# Altium project TFTInstrumentCluster.PrjPCB (part 1 of 2)
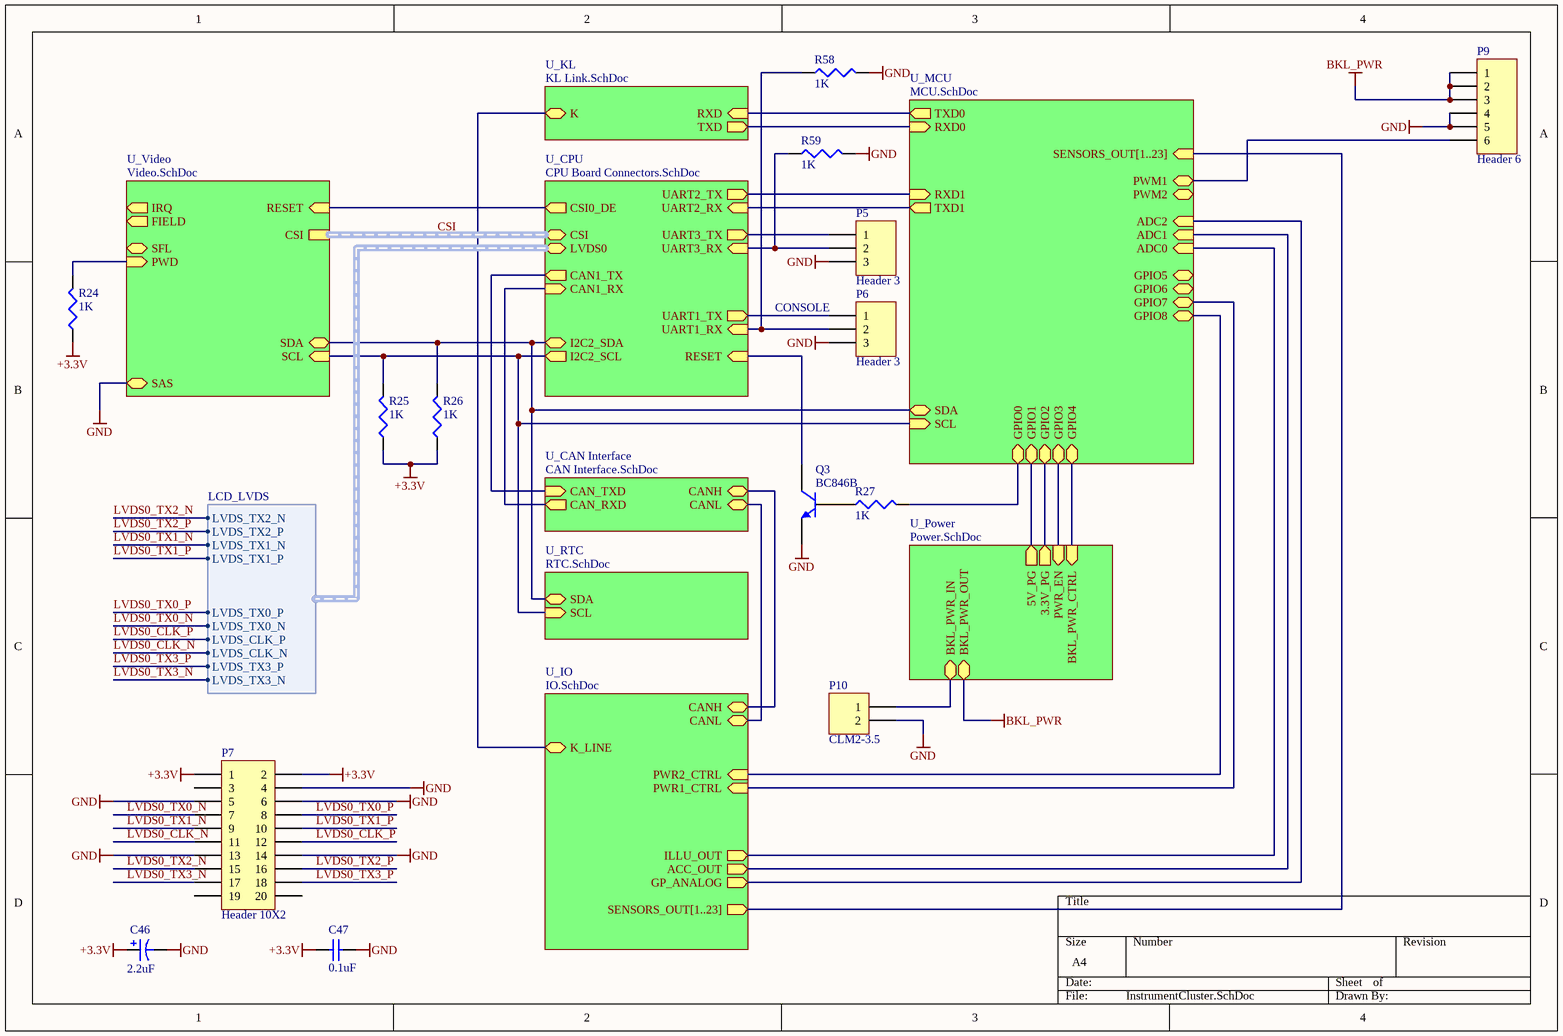
[diagram p0: InstrumentCluster.SchDoc]
11 sheets, 296 parts. Net scope: hierarchical (ports join the sheet entries above them; power ports are global).
Board file: InstrumentCluster.PcbDoc
Sheets:
  InstrumentCluster.SchDoc
    U_Power = Power.SchDoc
    U_Video = Video.SchDoc
    U_CPU = CPU Board Connectors.SchDoc
    U_MCU = MCU.SchDoc
    U_CAN Interface = CAN Interface.SchDoc
    U_KL = KL Link.SchDoc
    U_RTC = RTC.SchDoc
    U_IO = IO.SchDoc
      LC1 = LevelConverter.SchDoc
      LC2 = LevelConverter.SchDoc
      LC3 = LevelConverter.SchDoc
      LC4 = LevelConverter.SchDoc
      LC5 = LevelConverter.SchDoc
      LC6 = LevelConverter.SchDoc
      LC7 = LevelConverter.SchDoc
      LC8 = LevelConverter.SchDoc
      LC9 = LevelConverter.SchDoc
      LC10 = LevelConverter.SchDoc
      LC11 = LevelConverter.SchDoc
      LC12 = LevelConverter.SchDoc
      LC13 = LevelConverter.SchDoc
      LC14 = LevelConverter.SchDoc
      LC15 = LevelConverter.SchDoc
      LC16 = LevelConverter.SchDoc
      LC17 = LevelConverter.SchDoc
      LC18 = LevelConverter.SchDoc
      LC19 = LevelConverter.SchDoc
      LC20 = LevelConverter.SchDoc
      LC21 = LevelConverter.SchDoc
      LC22 = LevelConverter.SchDoc
      LC23 = LevelConverter.SchDoc
  External Connectors.SchDoc

## Sheet InstrumentCluster.SchDoc
size A4

### Parts
C46  2.2uF  [6032]
C47  0.1uF  [2012[0805]]
P5  Header 3  [HDR1X3]
P6  Header 3  [HDR1X3]
P7  Header 10X2  [HDR2X10]
P9  Header 6  [HDR1X6]
P10  CLM2-3.5  [CLM2-3.5]
Q3  BC846B  [SOT23_N]
R24  1K  [R2012[0805]]
R25  1K  [R2012[0805]]
R26  1K  [R2012[0805]]
R27  1K  [R2012[0805]]
R58  1K  [R2012[0805]]
R59  1K  [R2012[0805]]

### Sub-sheets
U_CAN Interface = CAN Interface.SchDoc: CAN_TXD (in), CAN_RXD (out), CANH (bidir), CANL (bidir)
U_CPU = CPU Board Connectors.SchDoc: CSI (harness CSI), CAN1_TX (out), CAN1_RX (in), I2C2_SDA (bidir), I2C2_SCL (out), UART2_TX (out), UART2_RX (in), UART3_RX (in), UART1_RX (in), UART3_TX (out), UART1_TX (out), RESET (in), LVDS0 (harness LCD_LVDS), CSI0_DE (out)
U_IO = IO.SchDoc: ILLU_OUT (out), ACC_OUT (out), K_LINE (bidir), CANH (bidir), CANL (bidir), PWR1_CTRL (in), PWR2_CTRL (in), GP_ANALOG (out), SENSORS_OUT[1..23] (out)
U_KL = KL Link.SchDoc: K (bidir), RXD (in), TXD (out)
U_MCU = MCU.SchDoc: PWM1 (bidir), SDA (bidir), SCL (in), GPIO5 (bidir), RXD1 (in), TXD1 (out), TXD0 (out), RXD0 (in), ADC1 (in), ADC0 (in), PWM2 (bidir), ADC2 (in), GPIO6 (bidir), GPIO7 (bidir), GPIO8 (bidir), SENSORS_OUT[1..23] (in), GPIO0 (bidir), GPIO1 (bidir), GPIO2 (bidir), GPIO3 (bidir), GPIO4 (bidir)
U_Power = Power.SchDoc: 3.3V_PG (out), 5V_PG (out), PWR_EN (in), BKL_PWR_CTRL (in), BKL_PWR_IN, BKL_PWR_OUT
U_RTC = RTC.SchDoc: SCL (in), SDA (bidir)
U_Video = Video.SchDoc: RESET (in), IRQ (out), FIELD (out), CSI (harness CSI), SFL (bidir), PWD (in), SCL (in), SDA (bidir), SAS

### Harnesses
LCD_LVDS: LVDS_TX0_P, LVDS_TX0_N, LVDS_TX1_P, LVDS_TX1_N, LVDS_TX2_P, LVDS_TX2_N, LVDS_CLK_P, LVDS_CLK_N, LVDS_TX3_P, LVDS_TX3_N

### Nets
+3.3V: C46.1 C47.2 P7.1 P7.2 R24.1 R25.1 R26.1
BKL_PWR: P9.1 P9.2 P9.3 ; sheet U_Power/BKL_PWR_OUT
GND: C46.2 C47.1 P5.3 P6.3 P7.4 P7.5 P7.6 P7.13 P7.14 P9.4 P9.5 P10.2 Q3.2(E) R58.2 R59.2 ; sheet U_Video/SAS
ACC_OUT: sheet U_MCU/ADC1, sheet U_IO/ACC_OUT
ADV_RST: sheet U_Video/RESET, sheet U_CPU/CSI0_DE
CAN1_RX: sheet U_CPU/CAN1_RX, sheet U_CAN Interface/CAN_RXD
CAN1_TX: sheet U_CPU/CAN1_TX, sheet U_CAN Interface/CAN_TXD
GP_ANALOG: sheet U_MCU/ADC2, sheet U_IO/GP_ANALOG
I2C2_SCL: R25.2 ; sheet U_Video/SCL, sheet U_CPU/I2C2_SCL, sheet U_MCU/SCL, sheet U_RTC/SCL
I2C2_SDA: R26.2 ; sheet U_Video/SDA, sheet U_CPU/I2C2_SDA, sheet U_MCU/SDA, sheet U_RTC/SDA
ILLU_OUT: sheet U_MCU/ADC0, sheet U_IO/ILLU_OUT
LVDS0_CLK_N: P7.11 ; sheet U_CPU/LVDS0.LVDS_CLK_N
LVDS0_CLK_P: P7.12 ; sheet U_CPU/LVDS0.LVDS_CLK_P
LVDS0_TX0_N: P7.7 ; sheet U_CPU/LVDS0.LVDS_TX0_N
LVDS0_TX0_P: P7.8 ; sheet U_CPU/LVDS0.LVDS_TX0_P
LVDS0_TX1_N: P7.9 ; sheet U_CPU/LVDS0.LVDS_TX1_N
LVDS0_TX1_P: P7.10 ; sheet U_CPU/LVDS0.LVDS_TX1_P
LVDS0_TX2_N: P7.15 ; sheet U_CPU/LVDS0.LVDS_TX2_N
LVDS0_TX2_P: P7.16 ; sheet U_CPU/LVDS0.LVDS_TX2_P
LVDS0_TX3_N: P7.17 ; sheet U_CPU/LVDS0.LVDS_TX3_N
LVDS0_TX3_P: P7.18 ; sheet U_CPU/LVDS0.LVDS_TX3_P
MISO: sheet U_MCU/TXD0, sheet U_KL/RXD
RESET: Q3.3(C) ; sheet U_CPU/RESET
UART1_RX: P6.2 R58.1 ; sheet U_CPU/UART1_RX
UART1_TX: P6.1 ; sheet U_CPU/UART1_TX
UART2_RX: sheet U_CPU/UART2_RX, sheet U_MCU/TXD1
UART2_TX: sheet U_CPU/UART2_TX, sheet U_MCU/RXD1
UART3_RX: P5.2 R59.1 ; sheet U_CPU/UART3_RX
UART3_TX: P5.1 ; sheet U_CPU/UART3_TX
VIN: P10.1 ; sheet U_Power/BKL_PWR_IN
NetP9_6: P9.6 ; sheet U_MCU/PWM1
NetP15_1: sheet U_CAN Interface/CANH, sheet U_IO/CANH
NetP15_2: sheet U_CAN Interface/CANL, sheet U_IO/CANL
NetP21_1: sheet U_KL/K, sheet U_IO/K_LINE
NetQ3_1: Q3.1(B) R27.1
NetR7_2: sheet U_Power/PWR_EN, sheet U_MCU/GPIO3
NetR12_2: sheet U_Power/BKL_PWR_CTRL, sheet U_MCU/GPIO4
NetR24_2: R24.2 ; sheet U_Video/PWD
NetR27_2: R27.2 ; sheet U_MCU/GPIO0
NetR38_2: sheet U_MCU/RXD0, sheet U_KL/TXD
NetR43_2: sheet U_MCU/GPIO7, sheet U_IO/PWR1_CTRL
NetR49_2: sheet U_MCU/GPIO8, sheet U_IO/PWR2_CTRL
NetU1_7: sheet U_Power/3.3V_PG, sheet U_MCU/GPIO2
NetU2_7: sheet U_Power/5V_PG, sheet U_MCU/GPIO1

Not connected (* = marked no-connect by the designer): P7 3 19 20

### Buses and harness runs
bus sheet U_IO/SENSORS_OUT[1..23] = sheet U_MCU/SENSORS_OUT[1..23]
harness CSI = sheet U_CPU/CSI = sheet U_Video/CSI

### Notes on the sheet
- CONSOLE

### Library data of the parts
C46 = 893D225X0025C2: Tantamount Built-In-Fuse Miniature, Molded-Case Solid Tantalum Chip Capacitor: 2.2uF, 20% Tolerance, 25 WVDC @ +85°C, Surge = 32V; Note: See Data Sheet for full range of components; Published: 19-Mar-2004; DatasheetDocument: 04-Feb-2003; PackageReference: 6032; Publisher: Altium Limited; Code_JEITA: 6032; ComponentLink1Description: Manufacturer Link; ComponentLink1URL: http://www.vishay.com/; ComponentLink2Description: Datasheet; ComponentLink2URL: http://www.vishay.com/docs/40008/893d.pdf; Value: 2.2uF
C47 = C0805: Ceramic Chip Capacitor - Standard; Note: Footprint corresponds to dimensions for bulk cassette packaging. This case size has tightened tolerances.; Published: 17-Jul-2002; LatestRevisionDate: 19-Mar-2004; LatestRevisionNote: Silkscreen size reduced.; DatasheetDocument: Mar-2001; PackageDocument: Mar-2001; PackageReference: 0805; Publisher: Altium Limited; Code_JEITA: 0805; Code_IPC: 2012[0805]; ComponentLink1Description: Manufacturer Link; ComponentLink1URL: http://www.kemet.com/; ComponentLink2Description: Datasheet; ComponentLink2URL: http://www.kemet.com/kemet/web/homepage/kechome.nsf/vapubfilesname/F3102TA.pdf/$file/F3102TA.pdf; Value: 0.1uF
P5 P6 = Header 3: Header, 3-Pin; LatestRevisionDate: 17-Jul-2002; LatestRevisionNote: Re-released for DXP Platform.; Publisher: Altium Limited
P7 = Header 10X2: Header, 10-Pin, Dual row; LatestRevisionDate: 17-Jul-2002; LatestRevisionNote: Re-released for DXP Platform.; Publisher: Altium Limited
P9 = Header 6: Header, 6-Pin; LatestRevisionDate: 17-Jul-2002; LatestRevisionNote: Re-released for DXP Platform.; Publisher: Altium Limited
Q3 = BC846B: NPN General-purpose Transistor; Published: 17-Sep-2003; LatestRevisionDate: 12-Dec-2006; LatestRevisionNote: IPC-7351 Footprint Added.; DatasheetVersion: 4-Feb-2002; PackageVersion: May-1999; PackageReference: SOT23; Publisher: Altium Limited; PackageDescription: 3-Pin SOT-23 Package 0.95 mm Pitch, 2.3 mm Lead Span; ComponentLink1Description: Manufacturer Link; ComponentLink1URL: http://www.semiconductors.philips.com/; ComponentLink2Description: Datasheet; ComponentLink2URL: http://www.semiconductors.philips.com/acrobat/datasheets/BC846_BC847_BC848_5.pdf
R24-R27 R58 R59 = R0805: Published: 8-Jun-2000; LatestRevisionDate: 29-May-2009; LatestRevisionNote: IPC-7351 Footprint Added.; PackageReference: J1-0603; Publisher: Altium Limited; PackageDescription: Chip Resistor; Value: 1K

## Sheet Power.SchDoc
size A4
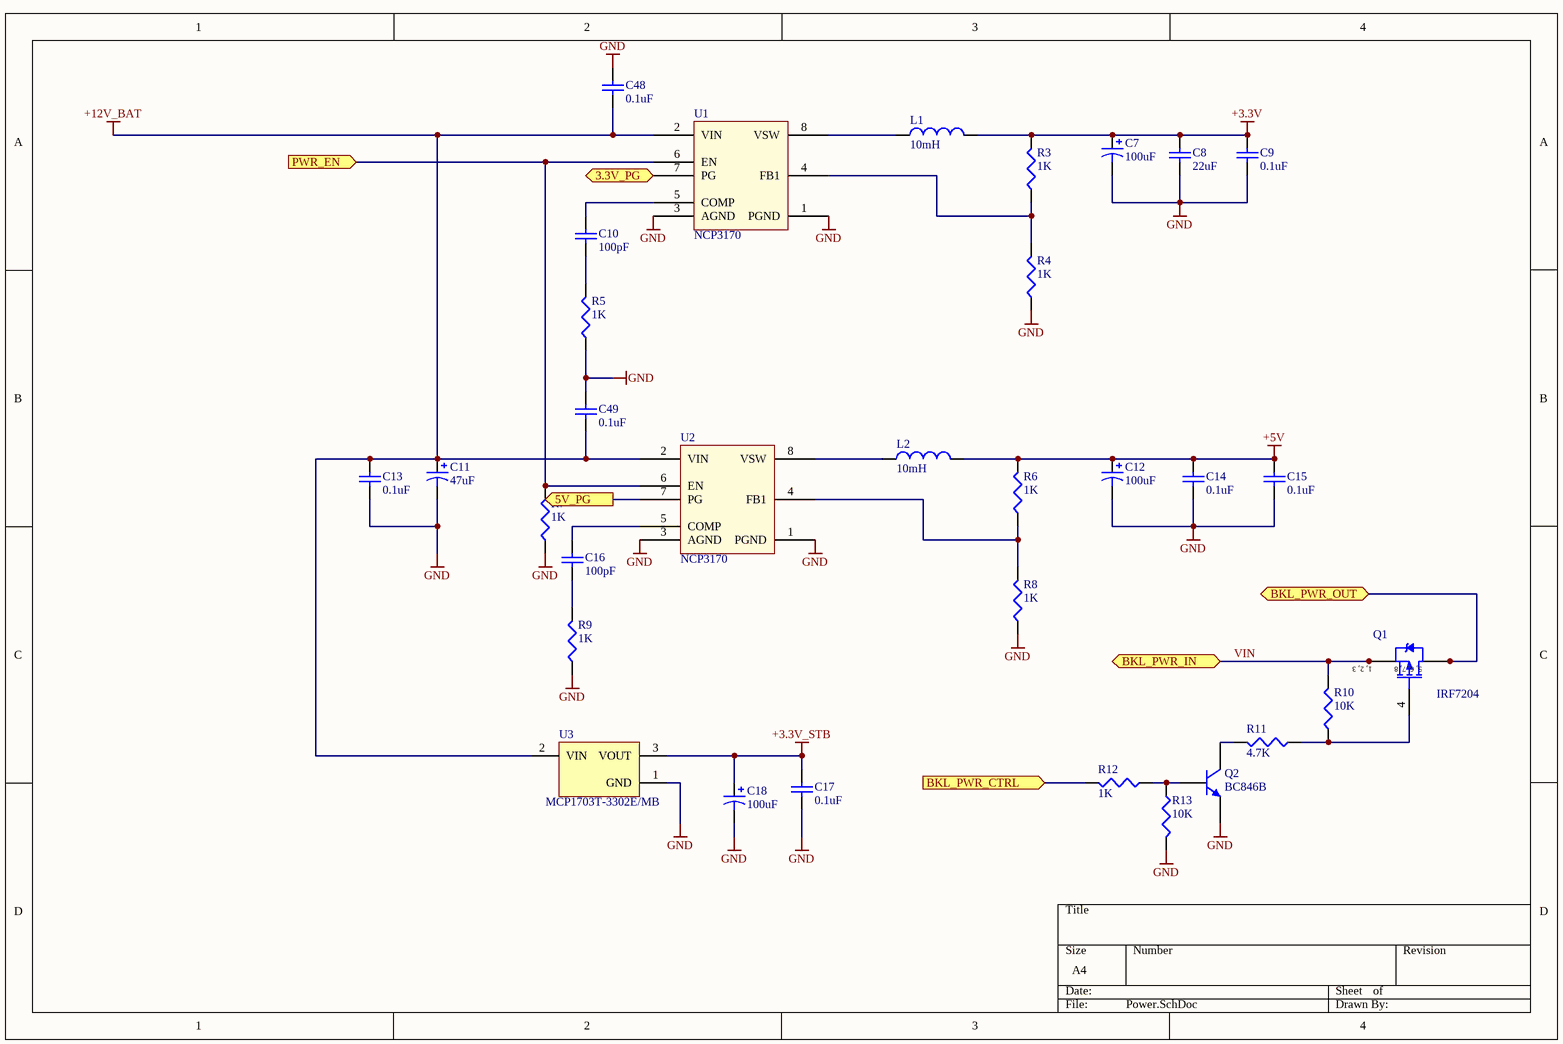
[diagram p1: Power.SchDoc]

### Parts
C7  100uF  [6032]
C8  22uF  [2012[0805]]
C9  0.1uF  [2012[0805]]
C10  100pF  [1608[0603]]
C11  47uF  [7343]
C12  100uF  [6032]
C13  0.1uF  [2012[0805]]
C14  0.1uF  [2012[0805]]
C15  0.1uF  [2012[0805]]
C16  100pF  [1608[0603]]
C17  0.1uF  [2012[0805]]
C18  100uF  [6032]
C48  0.1uF  [2012[0805]]
C49  0.1uF  [2012[0805]]
L1  10mH  [CDRH127]
L2  10mH  [CDRH127]
Q1  IRF7204  [SO-8_N]
Q2  BC846B  [SOT23_N]
R3  1K  [R2012[0805]]
R4  1K  [R2012[0805]]
R5  1K  [R1608[0603]]
R6  1K  [R2012[0805]]
R7  1K  [R1608[0603]]
R8  1K  [R2012[0805]]
R9  1K  [R1608[0603]]
R10  10K  [R2012[0805]]
R11  4.7K  [R2012[0805]]
R12  1K  [R2012[0805]]
R13  10K  [R2012[0805]]
U1  NCP3170  [SOIC127P600-8AM]
U2  NCP3170  [SOIC127P600-8AM]
U3  MCP1703T-3302E/MB  [SOT-89-MB3_N]

### Ports
3.3V_PG (out), 5V_PG (out), BKL_PWR_CTRL (in), BKL_PWR_IN, BKL_PWR_OUT, PWR_EN (in)

### Nets
+3.3V: C7.1 C8.2 C9.2 L1.2 R3.2
+3.3V_STB: C17.2 C18.1 U3.3(VOUT)
+5V: C12.1 C14.2 C15.2 L2.2 R6.2
+12V_BAT: C11.1 C13.2 C48.1 C49.1 U1.2(VIN) U2.2(VIN) U3.2(VIN)
BKL_PWR: Q1.5(D) Q1.6(D) Q1.7(D) Q1.8(D) ; port BKL_PWR_OUT
GND: C7.2 C8.1 C9.1 C11.2 C12.2 C13.1 C14.1 C15.1 C17.1 C18.2 C48.2 C49.2 Q2.2(E) R4.1 R5.1 R7.1 R8.1 R9.1 R13.2 U1.1(PGND) U1.3(AGND) U2.1(PGND) U2.3(AGND) U3.1(GND)
VIN: Q1.1(S) Q1.2(S) Q1.3(S) R10.2 ; port BKL_PWR_IN
NetC10_1: C10.1 R5.2
NetC10_2: C10.2 U1.5(COMP)
NetC16_1: C16.1 R9.2
NetC16_2: C16.2 U2.5(COMP)
NetL1_1: L1.1 U1.8(VSW)
NetL2_1: L2.1 U2.8(VSW)
NetQ1_4: Q1.4(G) R10.1 R11.1
NetQ2_1: Q2.1(B) R12.1 R13.1
NetQ2_3: Q2.3(C) R11.2
NetR3_1: R3.1 R4.2 U1.4(FB1)
NetR6_1: R6.1 R8.2 U2.4(FB1)
NetR7_2: R7.2 U1.6(EN) U2.6(EN) ; port PWR_EN
NetR12_2: R12.2 ; port BKL_PWR_CTRL
NetU1_7: U1.7(PG) ; port 3.3V_PG
NetU2_7: U2.7(PG) ; port 5V_PG

### Notes on the sheet
- (in symbol IRF7204) 1, 2, 3; 5, 6, 7, 8

### Library data of the parts
C7 C12 C18 = 893D225X0025C2: as C46 on sheet InstrumentCluster; Published: 19-Mar-2004; DatasheetDocument: 04-Feb-2003; PackageReference: 6032; Publisher: Altium Limited; Code_JEITA: 6032; ComponentLink1Description: Manufacturer Link; ComponentLink1URL: http://www.vishay.com/; ComponentLink2Description: Datasheet; ComponentLink2URL: http://www.vishay.com/docs/40008/893d.pdf; Value: 100uF
C8 C9 C13-C15 C17 C48 C49 = C0805: as C47 on sheet InstrumentCluster; Published: 17-Jul-2002; LatestRevisionDate: 19-Mar-2004; LatestRevisionNote: Silkscreen size reduced.; DatasheetDocument: Mar-2001; PackageDocument: Mar-2001; PackageReference: 0805; Publisher: Altium Limited; Code_JEITA: 0805; Code_IPC: 2012[0805]; ComponentLink1Description: Manufacturer Link; ComponentLink1URL: http://www.kemet.com/; ComponentLink2Description: Datasheet; ComponentLink2URL: http://www.kemet.com/kemet/web/homepage/kechome.nsf/vapubfilesname/F3102TA.pdf/$file/F3102TA.pdf
  C8: Value: 22uF
  C9 C13-C15 C17 C48 C49: Value: 0.1uF
C10 C16 = C0603: Ceramic Chip Capacitor - Standard; Note: Footprint corresponds to dimensions for bulk cassette packaging. This case size has tightened tolerances.; Published: 17-Jul-2002; LatestRevisionDate: 19-Mar-2004; LatestRevisionNote: Silkscreen size reduced.; DatasheetDocument: Mar-2001; PackageDocument: Mar-2001; PackageReference: 0603; Publisher: Altium Limited; Code_JEITA: 0603; Code_IPC: 1608 [0603]; ComponentLink1Description: Manufacturer Link; ComponentLink1URL: http://www.kemet.com/; ComponentLink2Description: Datasheet; ComponentLink2URL: http://www.kemet.com/kemet/web/homepage/kechome.nsf/vapubfilesname/F3102TA.pdf/$file/F3102TA.pdf; Value: 100pF
C11 = 893D156X0025D2: Tantamount Built-In-Fuse Miniature, Molded-Case Solid Tantalum Chip Capacitor: 15uF, 20% Tolerance, 25 WVDC @ +85°C, Surge = 32V; Note: See Data Sheet for full range of components; Published: 19-Mar-2004; DatasheetDocument: 04-Feb-2003; PackageReference: 7343; Publisher: Altium Limited; Code_JEITA: 7343; ComponentLink1Description: Manufacturer Link; ComponentLink1URL: http://www.vishay.com/; ComponentLink2Description: Datasheet; ComponentLink2URL: http://www.vishay.com/docs/40008/893d.pdf; Value: 47uF
L1 L2 = Inductor: Code_IEC: 1005; Published: 8-Jun-2000; LatestRevisionDate: 29-May-2009; LatestRevisionNote: IPC-7351 Footprint Added.; PackageReference: 0402-A; Publisher: Altium Limited; PackageDescription: Chip Inductor; Code_JEITA: 0402; Value: 10mH
Q1 = IRF7204: HEXFET Power MOSFET; Published: 8-Jun-2000; LatestRevisionDate: 13-Apr-2006; LatestRevisionNote: IPC-7351 Footprint Added.; DatasheetVersion: Aug-1997; PackageVersion: Feb-2001; PackageReference: SO-8; Publisher: Altium Limited; PackageDescription: 8-Pin Plastic Small Outline Integrated Circuit 1.27 mm Pitch; Code_JEDEC: MS-012-AA; Code_IPC: SOIC127P600-8; ComponentLink1Description: Manufacturer Link; ComponentLink1URL: http://www.irf.com/; ComponentLink2Description: Datasheet; ComponentLink2URL: http://www.irf.com/product-info/datasheets/data/irf7204.pdf
Q2 = BC846B: NPN General-purpose Transistor; Published: 17-Sep-2003; LatestRevisionDate: 12-Dec-2006; LatestRevisionNote: IPC-7351 Footprint Added.; DatasheetVersion: 4-Feb-2002; PackageVersion: May-1999; PackageReference: SOT23; Publisher: Altium Limited; PackageDescription: 3-Pin SOT-23 Package 0.95 mm Pitch, 2.3 mm Lead Span; ComponentLink1Description: Manufacturer Link; ComponentLink1URL: http://www.semiconductors.philips.com/; ComponentLink2Description: Datasheet; ComponentLink2URL: http://www.semiconductors.philips.com/acrobat/datasheets/BC846_BC847_BC848_5.pdf
R3 R4 R6 R8 R10-R13 = R0805: Published: 8-Jun-2000; LatestRevisionDate: 29-May-2009; LatestRevisionNote: IPC-7351 Footprint Added.; PackageReference: J1-0603; Publisher: Altium Limited; PackageDescription: Chip Resistor
  R3 R4 R6 R8 R12: Value: 1K
  R10 R13: Value: 10K
  R11: Value: 4.7K
R5 R7 R9 = R0603: Published: 8-Jun-2000; LatestRevisionDate: 29-May-2009; LatestRevisionNote: IPC-7351 Footprint Added.; PackageReference: J1-0603; Publisher: Altium Limited; PackageDescription: Chip Resistor; Value: 1K
U1 U2 = TCP3170
U3 = MCP1703T-3302E/MB: 250 mA, 16V, Low Quiescent Current LDO Regulator, 3-Pin SOT-89, Extended Temperature, Tape and Reel; DatasheetVersion: revD, Sep-2009; PackageVersion: revBB, Aug-2009; PackageReference: SOT-89-MB3; PackageDescription: 3-Lead Plastic Small Outline Transistor Header (MB) [SOT-89]; Code_IPC: SOT89; ComponentLink1Description: Manufacturer URL; ComponentLink1URL: http://www.microchip.com/; ComponentLink2Description: Datasheet; ComponentLink2URL: http://ww1.microchip.com/downloads/en/DeviceDoc/22049d.pdf; ComponentLink3Description: Package Specification; ComponentLink3URL: http://www.microchip.com/stellent/groups/techpub_sg/documents/packagingspec/en012702.pdf

## Sheet Video.SchDoc
size A4
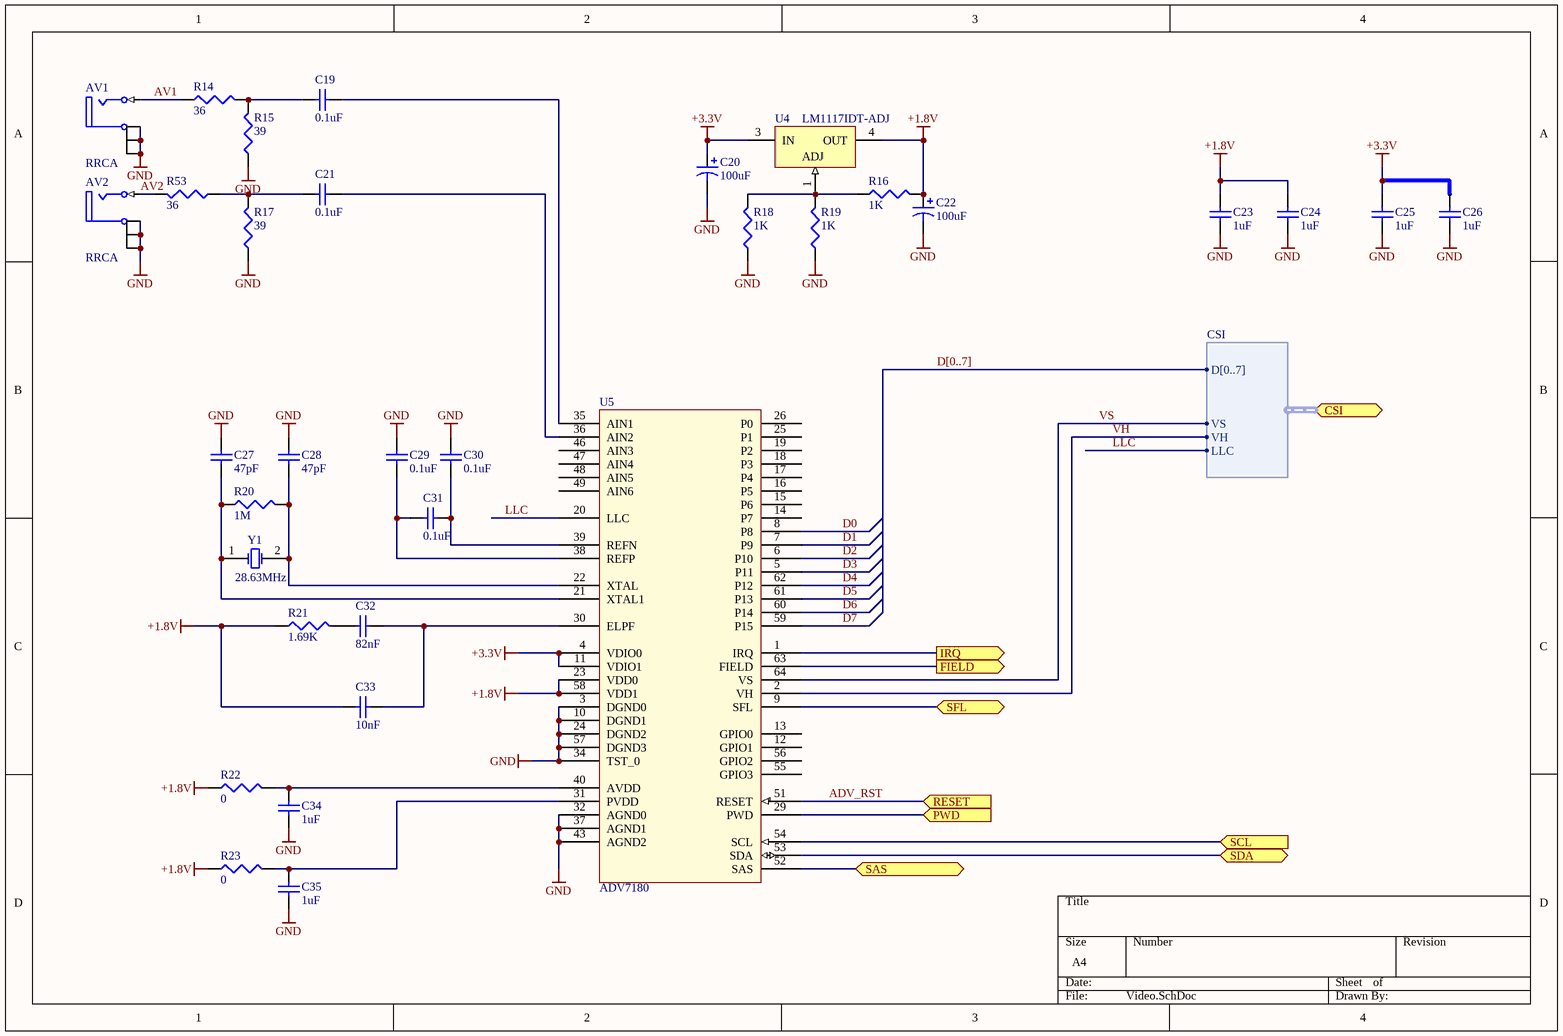
[diagram p2: Video.SchDoc]

### Parts
AV1  RRCA  [RCA-R]
AV2  RRCA  [RCA-R]
C19  0.1uF  [1608[0603]]
C20  100uF  [6032]
C21  0.1uF  [1608[0603]]
C22  100uF  [6032]
C23  1uF  [1608[0603]]
C24  1uF  [1608[0603]]
C25  1uF  [1608[0603]]
C26  1uF  [1608[0603]]
C27  47pF  [1608[0603]]
C28  47pF  [1608[0603]]
C29  0.1uF  [1608[0603]]
C30  0.1uF  [1608[0603]]
C31  0.1uF  [1608[0603]]
C32  82nF  [1608[0603]]
C33  10nF  [1608[0603]]
C34  1uF  [1608[0603]]
C35  1uF  [1608[0603]]
R14  36  [R2012[0805]]
R15  39  [R2012[0805]]
R16  1K  [R2012[0805]]
R17  39  [R2012[0805]]
R18  1K  [R2012[0805]]
R19  1K  [R2012[0805]]
R20  1M  [2012[0805]]
R21  1.69K  [R1608[0603]]
R22  0  [R1608[0603]]
R23  0  [R1608[0603]]
R53  36  [R2012[0805]]
U4  LM1117IDT-ADJ  [TD03B_N]
U5  ADV7180  [SQFP10X10-64]
Y1  28.63MHz  [HC49/4H_SMX]

### Ports
CSI (harness CSI), FIELD (out), IRQ (out), PWD (in), RESET (in), SAS, SCL (in), SDA (bidir), SFL (bidir)

### Harnesses
CSI: D[0..7], VS, VH, LLC

### Nets
+1.8V: C22.1 C23.2 C24.2 C33.1 R16.2 R21.1 R22.1 R23.1 U4.4(OUT) U5.23(VDD0) U5.58(VDD1)
+3.3V: C20.1 C25.2 C26.2 U4.3(IN) U5.4(VDIO0) U5.11(VDIO1)
GND: AV1.G1(Ground) AV1.G2(Ground) AV1.G3(Ground) AV2.G1(Ground) AV2.G2(Ground) AV2.G3(Ground) C20.2 C22.2 C23.1 C24.1 C25.1 C26.1 C27.1 C28.1 C29.2 C30.2 C34.2 C35.2 R15.1 R17.1 R18.1 R19.1 U5.3(DGND0) U5.10(DGND1) U5.24(DGND2) U5.32(AGND0) U5.34(TST_0) U5.37(AGND1) U5.43(AGND2) U5.52(SAS) U5.57(DGND3) ; port SAS
ADV_RST: U5.51(RESET) ; port RESET
AV1: AV1.SIGNAL(Signal) R14.1
AV2: AV2.SIGNAL(Signal) R53.2
D0: U5.8(P8)  [project net CSI0_DAT0]
D1: U5.7(P9)  [project net CSI0_DAT1]
D2: U5.6(P10)  [project net CSI0_DAT2]
D3: U5.5(P11)  [project net CSI0_DAT3]
D4: U5.62(P12)  [project net CSI0_DAT4]
D5: U5.61(P13)  [project net CSI0_DAT5]
D6: U5.60(P14)  [project net CSI0_DAT6]
D7: U5.59(P15)  [project net CSI0_DAT7]
I2C2_SCL: U5.54(SCL) ; port SCL
I2C2_SDA: U5.53(SDA) ; port SDA
LLC: U5.20(LLC) ; port CSI.LLC  [project net CSI.LLC]
VH: U5.2(VH) ; port CSI.VH  [project net CSI.VH]
VS: U5.64(VS) ; port CSI.VS  [project net CSI.VS]
NetC19_1: C19.1 U5.35(AIN1)
NetC19_2: C19.2 R14.2 R15.2
NetC21_1: C21.1 U5.36(AIN2)
NetC21_2: C21.2 R17.2 R53.1
NetC27_2: C27.2 R20.1 U5.21(XTAL1) Y1.1(OSC1)
NetC28_2: C28.2 R20.2 U5.22(XTAL) Y1.2(OSC2)
NetC29_1: C29.1 C31.2 U5.38(REFP)
NetC30_1: C30.1 C31.1 U5.39(REFN)
NetC32_1: C32.1 R21.2
NetC32_2: C32.2 C33.2 U5.30(ELPF)
NetC34_1: C34.1 R22.2 U5.40(AVDD)
NetC35_1: C35.1 R23.2 U5.31(PVDD)
NetR16_1: R16.1 R18.2 R19.2 U4.1(ADJ)
NetR24_2: U5.29(PWD) ; port PWD
NetU5_1: U5.1(IRQ) ; port IRQ
NetU5_9: U5.9(SFL) ; port SFL
NetU5_63: U5.63(FIELD) ; port FIELD

Not connected (* = marked no-connect by the designer): U5 12(GPIO1) 13(GPIO0) 14(P7) 15(P6) 16(P5) 17(P4) 18(P3) 19(P2) 25(P1) 26(P0) 46(AIN3) 47(AIN4) 48(AIN5) 49(AIN6) 55(GPIO3) 56(GPIO2)

### Buses and harness runs
bus D[0..7]

### Library data of the parts
AV1 AV2 = RCA: RCA Right Angle, Through hole, PCB mount
C19 C21 C23-C35 = C0603: as C10 on sheet Power; Published: 17-Jul-2002; LatestRevisionDate: 19-Mar-2004; LatestRevisionNote: Silkscreen size reduced.; DatasheetDocument: Mar-2001; PackageDocument: Mar-2001; PackageReference: 0603; Publisher: Altium Limited; Code_JEITA: 0603; Code_IPC: 1608 [0603]; ComponentLink1Description: Manufacturer Link; ComponentLink1URL: http://www.kemet.com/; ComponentLink2Description: Datasheet; ComponentLink2URL: http://www.kemet.com/kemet/web/homepage/kechome.nsf/vapubfilesname/F3102TA.pdf/$file/F3102TA.pdf
  C19 C21 C29-C31: Value: 0.1uF
  C23-C26 C34 C35: Value: 1uF
  C27 C28: Value: 47pF
  C32: Value: 82nF
  C33: Value: 10nF
C20 C22 = 893D225X0025C2: as C46 on sheet InstrumentCluster; Published: 19-Mar-2004; DatasheetDocument: 04-Feb-2003; PackageReference: 6032; Publisher: Altium Limited; Code_JEITA: 6032; ComponentLink1Description: Manufacturer Link; ComponentLink1URL: http://www.vishay.com/; ComponentLink2Description: Datasheet; ComponentLink2URL: http://www.vishay.com/docs/40008/893d.pdf; Value: 100uF
R14-R19 R53 = R0805: Published: 8-Jun-2000; LatestRevisionDate: 29-May-2009; LatestRevisionNote: IPC-7351 Footprint Added.; PackageReference: J1-0603; Publisher: Altium Limited; PackageDescription: Chip Resistor
  R14 R53: Value: 36
  R15 R17: Value: 39
  R16 R18 R19: Value: 1K
R20 = Res3: Resistor; Published: 8-Jun-2000; LatestRevisionDate: 29-May-2009; LatestRevisionNote: IPC-7351 Footprint Added.; PackageReference: J1-0603; Publisher: Altium Limited; PackageDescription: Chip Resistor; Value: 1M
R21-R23 = R0603: Published: 8-Jun-2000; LatestRevisionDate: 29-May-2009; LatestRevisionNote: IPC-7351 Footprint Added.; PackageReference: J1-0603; Publisher: Altium Limited; PackageDescription: Chip Resistor
  R21: Value: 1.69K
  R22 R23: Value: 0
U4 = LM1117IDT-ADJ: 800mA Low-Dropout Linear Regulator, 3-pin TO-252; Manufacturer: National Semiconductor; PackageTopMarking: NSUZXYTT*LM1117*IDT-ADJ; PowerWise: N; CompType: LDO IC; High-Reliability: Y; DatasheetVersion: Apr-2006; PackageVersion: revD, Feb-2009; PackageReference: TD03B; PackageDescription: TO252, Molded, Jedec, 6.8 x 6.10 x 2.30mm Body, 3 Lead, 2.28mm Pitch, Surface Mount; PartNumber: LM1117IDT-ADJ; RoHS: N; PinCount: 3; Code_JEDEC: TO-252-AA; ComponentLink1Description: Manufacturer URL; ComponentLink1URL: http://www.national.com/; ComponentLink2Description: LM1117 Datasheet; ComponentLink2URL: http://www.national.com/ds/LM/LM1117.pdf; ComponentLink3Description: LM1117 Web Page; ComponentLink3URL: http://www.national.com/pf/LM/LM1117.html; ComponentLink4Description: TD03B Package Page; ComponentLink4URL: http://www.national.com/packaging/folders/td03b.html
Y1 = XTAL: Crystal Oscillator; Published: 8-Jun-2000; LatestRevisionDate: 17-Jul-2002; LatestRevisionNote: Re-released for DXP Platform.; PackageReference: R38; Publisher: Altium Limited; PackageDescription: Crystal, Thru-Hole; 2 Leads; Body 3.1 x 8.2 mm (Dia.xH); Value: 28.63MHz

## Sheet CPU Board Connectors.SchDoc
size A4
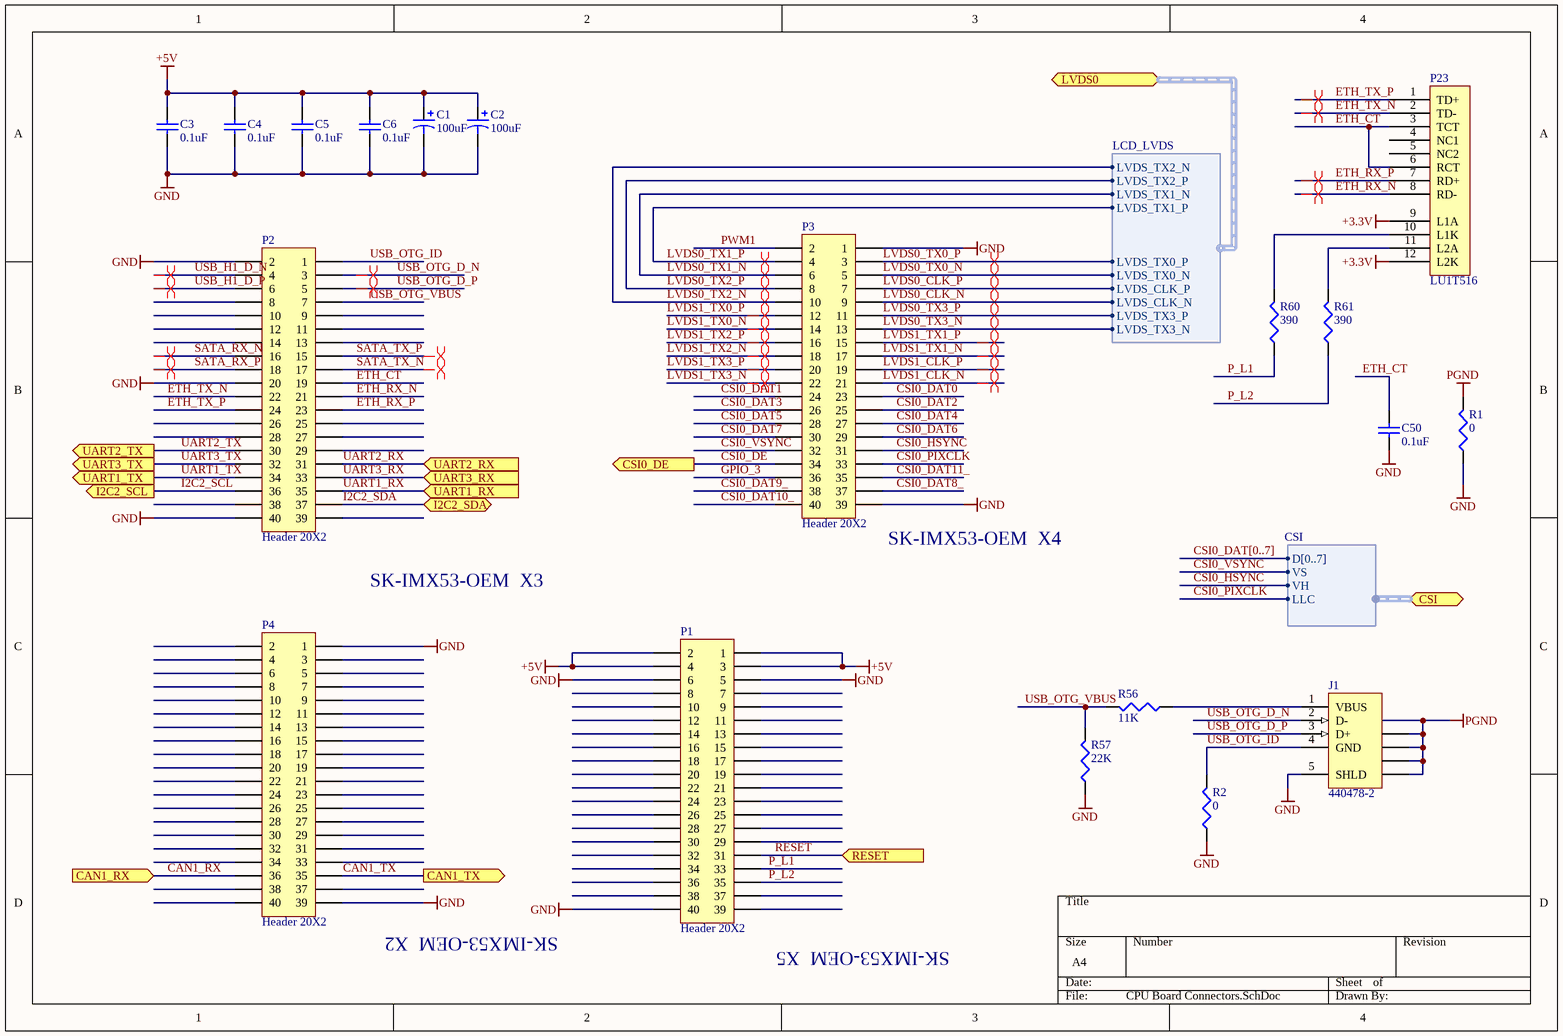
[diagram p3: CPU Board Connectors.SchDoc]

### Parts
C1  100uF  [6032]
C2  100uF  [6032]
C3  0.1uF  [2012[0805]]
C4  0.1uF  [2012[0805]]
C5  0.1uF  [2012[0805]]
C6  0.1uF  [2012[0805]]
C50  0.1uF  [2012[0805]]
J1  440478-2  [440478]
P1  Header 20X2  [HDR2X20_F]
P2  Header 20X2  [HDR2X20_F]
P3  Header 20X2  [HDR2X20_F]
P4  Header 20X2  [HDR2X20_F]
P23  LU1T516  [LU1T516]
R1  0  [R2012[0805]]
R2  0  [R2012[0805]]
R56  11K  [R2012[0805]]
R57  22K  [R2012[0805]]
R60  390  [R2012[0805]]
R61  390  [R2012[0805]]

### Ports
CAN1_RX (in), CAN1_TX (out), CSI0_DE (out), CSI (harness CSI), I2C2_SCL (out), I2C2_SDA (bidir), LVDS0 (harness LCD_LVDS), RESET (in), UART1_RX (in), UART1_TX (out), UART2_RX (in), UART2_TX (out), UART3_RX (in), UART3_TX (out)

### Harnesses
CSI: D[0..7], VS, VH, LLC
LCD_LVDS: LVDS_TX0_P, LVDS_TX0_N, LVDS_TX1_P, LVDS_TX1_N, LVDS_TX2_P, LVDS_TX2_N, LVDS_CLK_P, LVDS_CLK_N, LVDS_TX3_P, LVDS_TX3_N

### Nets
+3.3V: P23.9(L1A) P23.12(L2K)
+5V: C1.1 C2.1 C3.2 C4.2 C5.2 C6.2 P1.1 P1.2 P1.3 P1.4
GND: C1.2 C2.2 C3.1 C4.1 C5.1 C6.1 C50.2 J1.5(SHLD) P1.5 P1.6 P1.40 P2.2 P2.20 P2.40 P3.1 P3.39 P4.1 P4.39 R1.1 R2.1 R57.1
PGND: J1.6(SHLD) J1.7(SHLD) J1.8(SHLD) J1.9(SHLD) R1.2
CAN1_RX: P4.36 ; port CAN1_RX
CAN1_TX: P4.35 ; port CAN1_TX
CSI0_DAT0: P3.23
CSI0_DAT1: P3.24
CSI0_DAT2: P3.25
CSI0_DAT3: P3.26
CSI0_DAT4: P3.27
CSI0_DAT5: P3.28
CSI0_DAT6: P3.29
CSI0_DAT7: P3.30
CSI0_DAT8_: P3.37
CSI0_DAT9_: P3.38
CSI0_DAT10_: P3.40
CSI0_DAT11_: P3.35
CSI0_DE: P3.34 ; port CSI0_DE  [project net ADV_RST]
CSI0_HSYNC: P3.31 ; port CSI.VH  [project net CSI.VH]
CSI0_PIXCLK: P3.33 ; port CSI.LLC  [project net CSI.LLC]
CSI0_VSYNC: P3.32 ; port CSI.VS  [project net CSI.VS]
ETH_CT: C50.1 P2.19 P23.3(TCT) P23.6(RCT)
ETH_RX_N: P2.21 P23.8(RD-)
ETH_RX_P: P2.23 P23.7(RD+)
ETH_TX_N: P2.22 P23.2(TD-)
ETH_TX_P: P2.24 P23.1(TD+)
GPIO_3: P3.36
I2C2_SCL: P2.36 ; port I2C2_SCL
I2C2_SDA: P2.37 ; port I2C2_SDA
LVDS0_CLK_N: P3.9 ; port LVDS0.LVDS_CLK_N
LVDS0_CLK_P: P3.7 ; port LVDS0.LVDS_CLK_P
LVDS0_TX0_N: P3.5 ; port LVDS0.LVDS_TX0_N
LVDS0_TX0_P: P3.3 ; port LVDS0.LVDS_TX0_P
LVDS0_TX1_N: P3.6 ; port LVDS0.LVDS_TX1_N
LVDS0_TX1_P: P3.4 ; port LVDS0.LVDS_TX1_P
LVDS0_TX2_N: P3.10 ; port LVDS0.LVDS_TX2_N
LVDS0_TX2_P: P3.8 ; port LVDS0.LVDS_TX2_P
LVDS0_TX3_N: P3.13 ; port LVDS0.LVDS_TX3_N
LVDS0_TX3_P: P3.11 ; port LVDS0.LVDS_TX3_P
LVDS1_CLK_N: P3.21
LVDS1_CLK_P: P3.19
LVDS1_TX0_N: P3.14
LVDS1_TX0_P: P3.12
LVDS1_TX1_N: P3.17
LVDS1_TX1_P: P3.15
LVDS1_TX2_N: P3.18
LVDS1_TX2_P: P3.16
LVDS1_TX3_N: P3.22
LVDS1_TX3_P: P3.20
P_L1: P1.33 R60.1
P_L2: P1.35 R61.1
PWM1: P3.2
RESET: P1.31 ; port RESET
SATA_RX_N: P2.16
SATA_RX_P: P2.18
SATA_TX_N: P2.17
SATA_TX_P: P2.15
UART1_RX: P2.35 ; port UART1_RX
UART1_TX: P2.34 ; port UART1_TX
UART2_RX: P2.31 ; port UART2_RX
UART2_TX: P2.30 ; port UART2_TX
UART3_RX: P2.33 ; port UART3_RX
UART3_TX: P2.32 ; port UART3_TX
USB_H1_D_N: P2.4
USB_H1_D_P: P2.6
USB_OTG_D_N: J1.2(D-) P2.3
USB_OTG_D_P: J1.3(D+) P2.5
USB_OTG_ID: J1.4(GND) P2.1 R2.2
USB_OTG_VBUS: P2.7 R56.2 R57.2
NetJ1_1: J1.1(VBUS) R56.1
NetP23_10: P23.10(L1K) R60.2
NetP23_11: P23.11(L2A) R61.2

Not connected (* = marked no-connect by the designer): P1 7 8 9 10 11 12 13 14 15 16 17 18 19 20 21 22 23 24 25 26 27 28 29 30 32 34 36 37 38 39; P2 8 9 10 11 12 13 14 25 26 27 28 29 38 39; P4 2 3 4 5 6 7 8 9 10 11 12 13 14 15 16 17 18 19 20 21 22 23 24 25 26 27 28 29 30 31 32 33 34 37 38 40; P23 4(NC1) 5(NC2)

### Buses and harness runs
bus CSI0_DAT[0..7]

### Layout directives
differential pair: ETH_RX_N, ETH_RX_P, ETH_TX_N, ETH_TX_P, LVDS0_CLK_N, LVDS0_CLK_P, LVDS0_TX0_N, LVDS0_TX0_P, LVDS0_TX1_N, LVDS0_TX1_P, LVDS0_TX2_N, LVDS0_TX2_P, LVDS0_TX3_N, LVDS0_TX3_P, LVDS1_CLK_N, LVDS1_CLK_P, LVDS1_TX0_N, LVDS1_TX0_P, LVDS1_TX1_N, LVDS1_TX1_P, LVDS1_TX2_N, LVDS1_TX2_P, LVDS1_TX3_N, LVDS1_TX3_P, SATA_RX_N, SATA_RX_P, SATA_TX_N, SATA_TX_P, USB_H1_D_N, USB_H1_D_P, USB_OTG_D_N, USB_OTG_D_P

### Notes on the sheet
- (near P3) SK-IMX53-OEM  X4
- SK-IMX53-OEM  X3
- (near P4) SK-IMX53-OEM  X2
- (near P1) SK-IMX53-OEM  X5

### Library data of the parts
C1 C2 = 893D225X0025C2: as C46 on sheet InstrumentCluster; Published: 19-Mar-2004; DatasheetDocument: 04-Feb-2003; PackageReference: 6032; Publisher: Altium Limited; Code_JEITA: 6032; ComponentLink1Description: Manufacturer Link; ComponentLink1URL: http://www.vishay.com/; ComponentLink2Description: Datasheet; ComponentLink2URL: http://www.vishay.com/docs/40008/893d.pdf; Value: 100uF
C3-C6 C50 = C0805: as C47 on sheet InstrumentCluster; Published: 17-Jul-2002; LatestRevisionDate: 19-Mar-2004; LatestRevisionNote: Silkscreen size reduced.; DatasheetDocument: Mar-2001; PackageDocument: Mar-2001; PackageReference: 0805; Publisher: Altium Limited; Code_JEITA: 0805; Code_IPC: 2012[0805]; ComponentLink1Description: Manufacturer Link; ComponentLink1URL: http://www.kemet.com/; ComponentLink2Description: Datasheet; ComponentLink2URL: http://www.kemet.com/kemet/web/homepage/kechome.nsf/vapubfilesname/F3102TA.pdf/$file/F3102TA.pdf; Value: 0.1uF
J1 = 440478-2: USB 2.0, Right Angle, SMT, A Type, Receptacle, 5 Position, Black; ContactMaterial: Phosphor Bronze; ContactPlating: Gold (30) over Nickel; PCB_Layout: Complies with manufacturer's recommendation.; DrillSize: Corresponds to nominal value.; PanelGround: Without; Published: 15-Jul-2004; DatasheetDocument: 15-Nov-2002; PackageDocument: 15-Nov-2002; PackageReference: 440478; Publisher: Altium Limited; HousingMaterial: Thermoplastic; ComponentLink1Description: Manufacturer Link; ComponentLink1URL: http://www.tycoelectronics.com/; ComponentLink2Description: Packaging Specification; ComponentLink2URL: http://ecommas.tycoelectronics.com/commerce/DocumentDelivery/DDEController?Action=showdoc&DocId=Customer+Drawing%7F440478%7FB%7Fpdf%7FEnglish%7FC_440478_B.pdf
P1-P4 = Header 20X2: Header, 20-Pin, Dual row; LatestRevisionDate: 17-Jul-2002; LatestRevisionNote: Re-released for DXP Platform.; Publisher: Altium Limited
R1 R2 R56 R57 R60 R61 = R0805: Published: 8-Jun-2000; LatestRevisionDate: 29-May-2009; LatestRevisionNote: IPC-7351 Footprint Added.; PackageReference: J1-0603; Publisher: Altium Limited; PackageDescription: Chip Resistor
  R1 R2: Value: 0
  R56: Value: 11K
  R57: Value: 22K
  R60 R61: Value: 390

## Sheet MCU.SchDoc
size A4
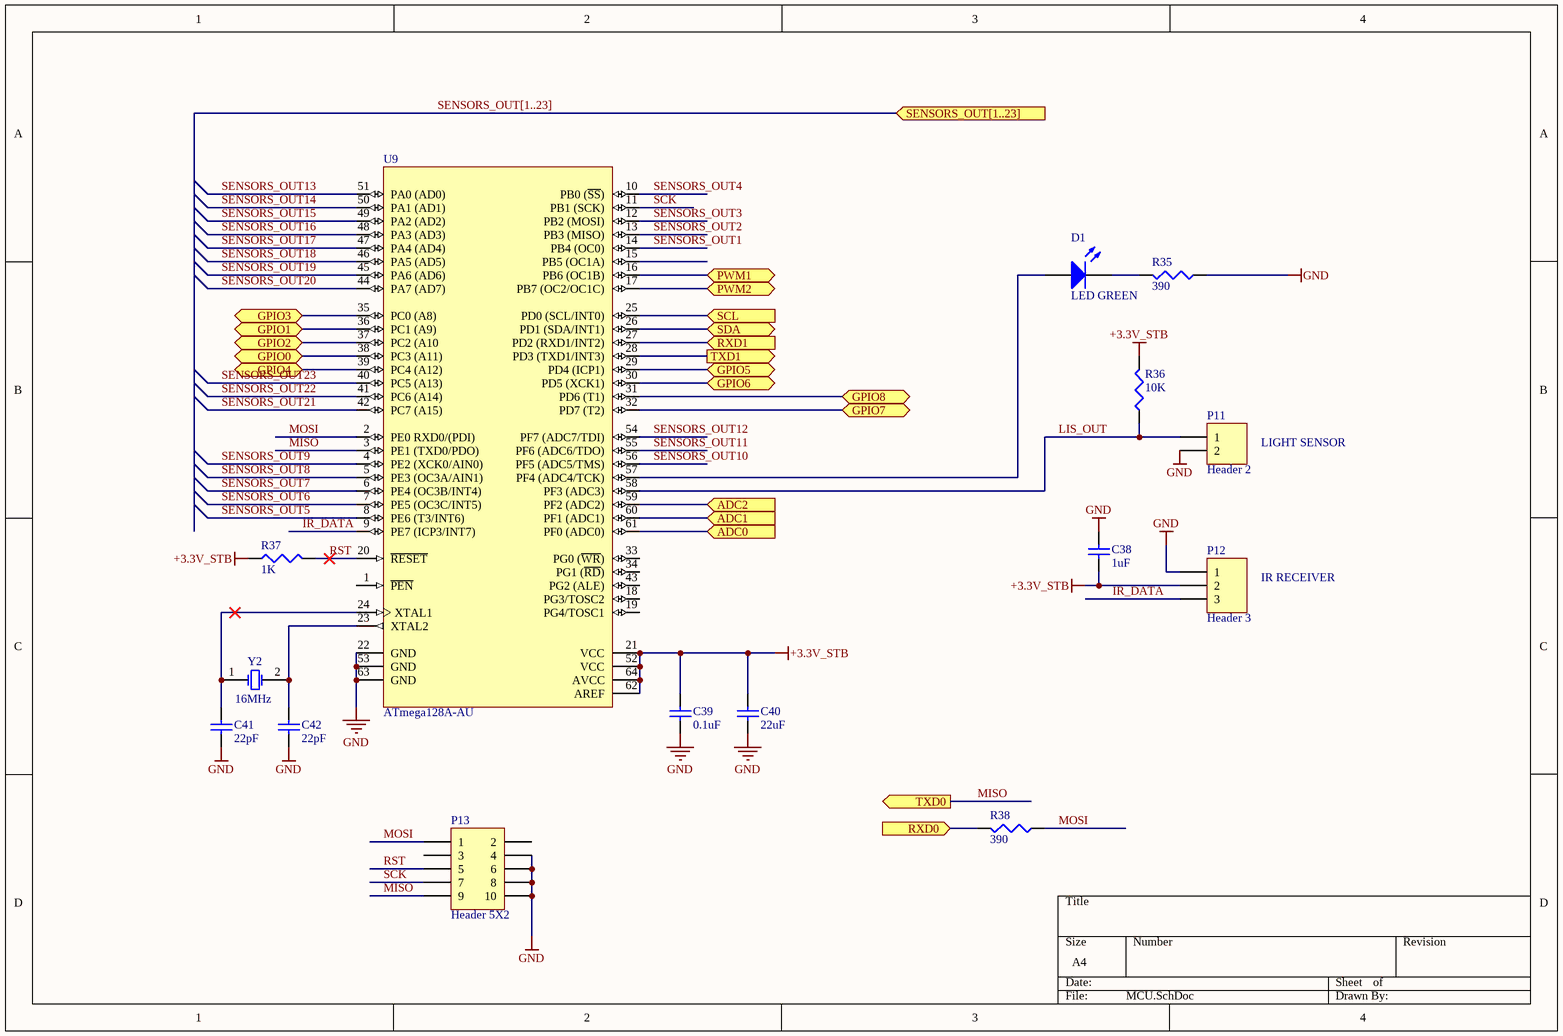
[diagram p4: MCU.SchDoc]

### Parts
C38  1uF  [1608[0603]]
C39  0.1uF  [2012[0805]]
C40  22uF  [2012[0805]]
C41  22pF  [2012[0805]]
C42  22pF  [2012[0805]]
D1  LED GREEN  [2012[0805]]
P11  Header 2  [HDR1X2]
P12  Header 3  [HDR1X3]
P13  Header 5X2  [HDR2X5]
R35  390  [R2012[0805]]
R36  10K  [R2012[0805]]
R37  1K  [R2012[0805]]
R38  390  [R2012[0805]]
U9  ATmega128A-AU  [64A_N]
Y2  16MHz  [HC49/4H_SMX]

### Ports
ADC0 (in), ADC1 (in), ADC2 (in), GPIO0 (bidir), GPIO1 (bidir), GPIO2 (bidir), GPIO3 (bidir), GPIO4 (bidir), GPIO5 (bidir), GPIO6 (bidir), GPIO7 (bidir), GPIO8 (bidir), PWM1 (bidir), PWM2 (bidir), RXD0 (in), RXD1 (in), SCL (in), SDA (bidir), SENSORS_OUT[1..23] (in), TXD0 (out), TXD1 (out)

### Nets
+3.3V_STB: C38.1 C39.2 C40.2 P12.2 R36.2 R37.1 U9.21(VCC) U9.52(VCC) U9.62(AREF) U9.64(AVCC)
GND: C38.2 C39.1 C40.1 C41.1 C42.1 P11.2 P12.1 P13.4 P13.6 P13.8 P13.10 R35.1 U9.22(GND) U9.53(GND) U9.63(GND)
ACC_OUT: U9.60(PF1_(ADC1)) ; port ADC1
GP_ANALOG: U9.59(PF2_(ADC2)) ; port ADC2
I2C2_SCL: U9.25(PD0_(SCL/INT0)) ; port SCL
I2C2_SDA: U9.26(PD1_(SDA/INT1)) ; port SDA
ILLU_OUT: U9.61(PF0_(ADC0)) ; port ADC0
IR_DATA: P12.3 U9.9(PE7_(ICP3/INT7))
LIS_OUT: P11.1 R36.1 U9.58(PF3_(ADC3))
MISO: P13.9 U9.3(PE1_(TXD0/PDO)) ; port TXD0
MOSI: P13.1 R38.1 U9.2(PE0_RXD0/(PDI))
RST: P13.5 R37.2 U9.20(~{RESET})
SCK: P13.7 U9.11(PB1_(SCK))
SENSORS_OUT1: U9.14(PB4_(OC0))
SENSORS_OUT2: U9.13(PB3_(MISO))
SENSORS_OUT3: U9.12(PB2_(MOSI))
SENSORS_OUT4: U9.10(PB0_(~{SS}))
SENSORS_OUT5: U9.8(PE6_(T3/INT6))
SENSORS_OUT6: U9.7(PE5_(OC3C/INT5))
SENSORS_OUT7: U9.6(PE4_(OC3B/INT4))
SENSORS_OUT8: U9.5(PE3_(OC3A/AIN1))
SENSORS_OUT9: U9.4(PE2_(XCK0/AIN0))
SENSORS_OUT10: U9.56(PF5_(ADC5/TMS))
SENSORS_OUT11: U9.55(PF6_(ADC6/TDO))
SENSORS_OUT12: U9.54(PF7_(ADC7/TDI))
SENSORS_OUT13: U9.51(PA0_(AD0))
SENSORS_OUT14: U9.50(PA1_(AD1))
SENSORS_OUT15: U9.49(PA2_(AD2))
SENSORS_OUT16: U9.48(PA3_(AD3))
SENSORS_OUT17: U9.47(PA4_(AD4))
SENSORS_OUT18: U9.46(PA5_(AD5))
SENSORS_OUT19: U9.45(PA6_(AD6))
SENSORS_OUT20: U9.44(PA7_(AD7))
SENSORS_OUT21: U9.42(PC7_(A15))
SENSORS_OUT22: U9.41(PC6_(A14))
SENSORS_OUT23: U9.40(PC5_(A13))
UART2_RX: U9.28(PD3_(TXD1/INT3)) ; port TXD1
UART2_TX: U9.27(PD2_(RXD1/INT2)) ; port RXD1
NetC41_2: C41.2 U9.24(XTAL1) Y2.1(OSC1)
NetC42_2: C42.2 U9.23(XTAL2) Y2.2(OSC2)
NetD1_1: D1.1(A) U9.57(PF4_(ADC4/TCK))
NetD1_2: D1.2(K) R35.2
NetP9_6: U9.16(PB6_(OC1B)) ; port PWM1
NetR7_2: U9.35(PC0_(A8)) ; port GPIO3
NetR12_2: U9.39(PC4_(A12)) ; port GPIO4
NetR27_2: U9.38(PC3_(A11)) ; port GPIO0
NetR38_2: R38.2 ; port RXD0
NetR43_2: U9.32(PD7_(T2)) ; port GPIO7
NetR49_2: U9.31(PD6_(T1)) ; port GPIO8
NetU1_7: U9.37(PC2_(A10) ; port GPIO2
NetU2_7: U9.36(PC1_(A9)) ; port GPIO1
NetU9_17: U9.17(PB7_(OC2/OC1C)) ; port PWM2
NetU9_29: U9.29(PD4_(ICP1)) ; port GPIO5
NetU9_30: U9.30(PD5_(XCK1)) ; port GPIO6

Not connected (* = marked no-connect by the designer): P13 2 3; U9 1(~{PEN}) 15(PB5_(OC1A)) 18(PG3/TOSC2) 19(PG4/TOSC1) 33(PG0_(~{WR})) 34(PG1_(~{RD})) 43(PG2_(ALE))

### Buses and harness runs
bus SENSORS_OUT[1..23] = port SENSORS_OUT[1..23]

### Notes on the sheet
- LIGHT SENSOR
- IR RECEIVER

### Library data of the parts
C38 = C0603: as C10 on sheet Power; Published: 17-Jul-2002; LatestRevisionDate: 19-Mar-2004; LatestRevisionNote: Silkscreen size reduced.; DatasheetDocument: Mar-2001; PackageDocument: Mar-2001; PackageReference: 0603; Publisher: Altium Limited; Code_JEITA: 0603; Code_IPC: 1608 [0603]; ComponentLink1Description: Manufacturer Link; ComponentLink1URL: http://www.kemet.com/; ComponentLink2Description: Datasheet; ComponentLink2URL: http://www.kemet.com/kemet/web/homepage/kechome.nsf/vapubfilesname/F3102TA.pdf/$file/F3102TA.pdf; Value: 1uF
C39-C42 = C0805: as C47 on sheet InstrumentCluster; Published: 17-Jul-2002; LatestRevisionDate: 19-Mar-2004; LatestRevisionNote: Silkscreen size reduced.; DatasheetDocument: Mar-2001; PackageDocument: Mar-2001; PackageReference: 0805; Publisher: Altium Limited; Code_JEITA: 0805; Code_IPC: 2012[0805]; ComponentLink1Description: Manufacturer Link; ComponentLink1URL: http://www.kemet.com/; ComponentLink2Description: Datasheet; ComponentLink2URL: http://www.kemet.com/kemet/web/homepage/kechome.nsf/vapubfilesname/F3102TA.pdf/$file/F3102TA.pdf
  C39: Value: 0.1uF
  C40: Value: 22uF
  C41 C42: Value: 22pF
D1 = LED0: Typical INFRARED GaAs LED; Published: 8-Jun-2000; LatestRevisionDate: 08-Jul-2005; LatestRevisionNote: Mech Layer 1 removed.; PackageReference: LED-0; Publisher: Altium Limited; PackageDescription: LED; 2 Leads
P11 = Header 2: Header, 2-Pin; LatestRevisionDate: 17-Jul-2002; LatestRevisionNote: Re-released for DXP Platform.; Publisher: Altium Limited
P12 = Header 3: Header, 3-Pin; LatestRevisionDate: 17-Jul-2002; LatestRevisionNote: Re-released for DXP Platform.; Publisher: Altium Limited
P13 = Header 5X2: Header, 5-Pin, Dual row; LatestRevisionDate: 17-Jul-2002; LatestRevisionNote: Re-released for DXP Platform.; Publisher: Altium Limited
R35-R38 = R0805: Published: 8-Jun-2000; LatestRevisionDate: 29-May-2009; LatestRevisionNote: IPC-7351 Footprint Added.; PackageReference: J1-0603; Publisher: Altium Limited; PackageDescription: Chip Resistor
  R35 R38: Value: 390
  R36: Value: 10K
  R37: Value: 1K
U9 = ATmega128A-AU: 8-bit AVR Microcontroller, 128KB Flash, 4KB EEPROM, 4KB SRAM, 64-pin TQFP, Industrial Grade (-40°C to 85°C); Published: 1-Apr-2010; DatasheetVersion: revE, Feb-2010; PackageVersion: revB, Oct-2001; PackageReference: 64A; Publisher: Altium Limited; PackageDescription: 64-Pin Plastic Thin Profile Quad Flat Pack, 14 x 14 x 1.0 mm Body, 0.8 mm Pitch (TQFP); Supplier 1: Digi-Key; Supplier Part Number 1: ATMEGA128A-AU-ND; Supplier 2: Farnell; Supplier Part Number 2: 1773397; Supplier 3: Mouser; Supplier Part Number 3: 556-ATMEGA128A-AU; Code_JEDEC: MS-026-AEB; ComponentLink1Description: Manufacturer Link; ComponentLink1URL: http://www.atmel.com/products/avr/default.asp?; ComponentLink2Description: ATmega128A Datasheet; ComponentLink2URL: http://www.atmel.com/dyn/resources/prod_documents/doc8151.pdf; ComponentLink3Description: ATmega128A Summary; ComponentLink3URL: http://www.atmel.com/dyn/resources/prod_documents/8151S.pdf; ComponentLink4Description: Atmel.com Home; ComponentLink4URL: http://www.atmel.com
Y2 = XTAL: Crystal Oscillator; Published: 8-Jun-2000; LatestRevisionDate: 17-Jul-2002; LatestRevisionNote: Re-released for DXP Platform.; PackageReference: R38; Publisher: Altium Limited; PackageDescription: Crystal, Thru-Hole; 2 Leads; Body 3.1 x 8.2 mm (Dia.xH); Value: 16MHz

## Sheet CAN Interface.SchDoc
size A4
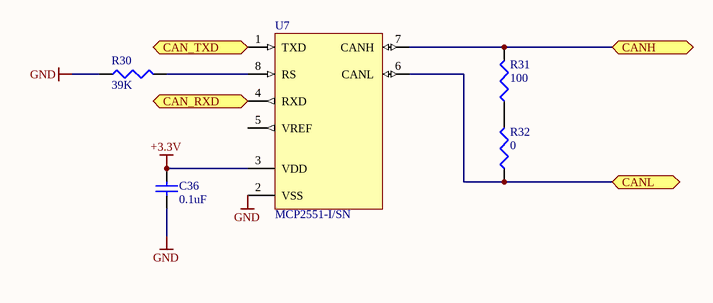
[diagram p5: CAN Interface.SchDoc]

### Parts
C36  0.1uF  [2012[0805]]
R30  39K  [R2012[0805]]
R31  100  [R2012[0805]]
R32  0  [R2012[0805]]
U7  MCP2551-I/SN  [SOIC-SN8_N]

### Ports
CAN_RXD (out), CAN_TXD (in), CANH (bidir), CANL (bidir)

### Nets
+3.3V: C36.2 U7.3(VDD)
GND: C36.1 R30.1 U7.2(VSS)
CAN1_RX: U7.4(RXD) ; port CAN_RXD
CAN1_TX: U7.1(TXD) ; port CAN_TXD
NetP15_1: R31.2 U7.7(CANH) ; port CANH
NetP15_2: R32.1 U7.6(CANL) ; port CANL
NetR30_2: R30.2 U7.8(RS)
NetR31_1: R31.1 R32.2

Not connected (* = marked no-connect by the designer): U7 5(VREF)

### Library data of the parts
C36 = C0805: as C47 on sheet InstrumentCluster; Published: 17-Jul-2002; LatestRevisionDate: 19-Mar-2004; LatestRevisionNote: Silkscreen size reduced.; DatasheetDocument: Mar-2001; PackageDocument: Mar-2001; PackageReference: 0805; Publisher: Altium Limited; Code_JEITA: 0805; Code_IPC: 2012[0805]; ComponentLink1Description: Manufacturer Link; ComponentLink1URL: http://www.kemet.com/; ComponentLink2Description: Datasheet; ComponentLink2URL: http://www.kemet.com/kemet/web/homepage/kechome.nsf/vapubfilesname/F3102TA.pdf/$file/F3102TA.pdf; Value: 0.1uF
R30-R32 = R0805: Published: 8-Jun-2000; LatestRevisionDate: 29-May-2009; LatestRevisionNote: IPC-7351 Footprint Added.; PackageReference: J1-0603; Publisher: Altium Limited; PackageDescription: Chip Resistor
  R30: Value: 39K
  R31: Value: 100
  R32: Value: 0
U7 = MCP2551-I/SN: High-Speed CAN Transceiver, 8-Pin SOIC, Industrial Temperature; DatasheetVersion: revF, Jul-2010; PackageVersion: revBB, Aug-2009; PackageReference: SOIC-SN8; PackageDescription: 8-Lead Plastic Small Outline (SN) - Narrow, 3.90mm Body [SOIC]; Code_JEDEC: MS-012; Code_IPC: SOIC127P600-8; ComponentLink1Description: Manufacturer URL; ComponentLink1URL: http://www.microchip.com/; ComponentLink2Description: Datasheet; ComponentLink2URL: http://ww1.microchip.com/downloads/en/DeviceDoc/21667F.pdf; ComponentLink3Description: Package Specification; ComponentLink3URL: http://www.microchip.com/stellent/groups/techpub_sg/documents/packagingspec/en012702.pdf

## Sheet KL Link.SchDoc
size A4
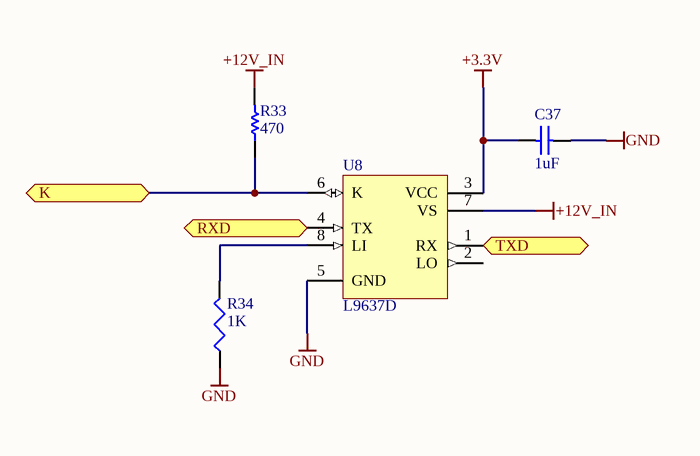
[diagram p6: KL Link.SchDoc]

### Parts
C37  1uF  [2012[0805]]
R33  470  [6332[2512]]
R34  1K  [R2012[0805]]
U8  L9637D  [SO8_N]

### Ports
K (bidir), RXD (in), TXD (out)

### Nets
+3.3V: C37.1 U8.3(VCC)
+12V_IN: R33.2 U8.7(VS)
GND: C37.2 R34.1 U8.5(GND)
MISO: U8.4(TX) ; port RXD
NetP21_1: R33.1 U8.6(K) ; port K
NetR34_2: R34.2 U8.8(LI)
NetR38_2: U8.1(RX) ; port TXD

Not connected (* = marked no-connect by the designer): U8 2(LO)

### Library data of the parts
C37 = C0805: as C47 on sheet InstrumentCluster; Published: 17-Jul-2002; LatestRevisionDate: 19-Mar-2004; LatestRevisionNote: Silkscreen size reduced.; DatasheetDocument: Mar-2001; PackageDocument: Mar-2001; PackageReference: 0805; Publisher: Altium Limited; Code_JEITA: 0805; Code_IPC: 2012[0805]; ComponentLink1Description: Manufacturer Link; ComponentLink1URL: http://www.kemet.com/; ComponentLink2Description: Datasheet; ComponentLink2URL: http://www.kemet.com/kemet/web/homepage/kechome.nsf/vapubfilesname/F3102TA.pdf/$file/F3102TA.pdf; Value: 1uF
R33 = Res1: Resistor; Published: 8-Jun-2000; LatestRevisionDate: 17-Jul-2002; LatestRevisionNote: Re-released for DXP Platform.; PackageReference: AXIAL-0.3; Publisher: Altium Limited; PackageDescription: Axial Device, Thru-Hole; 2 Leads; 0.3 in Pin Spacing; Value: 470
R34 = R0805: Published: 8-Jun-2000; LatestRevisionDate: 29-May-2009; LatestRevisionNote: IPC-7351 Footprint Added.; PackageReference: J1-0603; Publisher: Altium Limited; PackageDescription: Chip Resistor; Value: 1K
U8 = L9637D: ISO 9141 Interface; Published: 24-Aug-2001; LatestRevisionDate: 13-Apr-2006; LatestRevisionNote: IPC-7351 Footprint Added.; DatasheetVersion: Dec-1998; PackageVersion: Dec-2002; PackageReference: SO8; Publisher: Altium Limited; PackageDescription: 8-Pin Small Outline Integrated Circuit 1.27 mm Pitch; Code_JEDEC: MS-012-AA; Code_IPC: SOIC127P600-8; ComponentLink1Description: Manufacturer Link; ComponentLink1URL: http://www.st.com/; ComponentLink2Description: Datasheet; ComponentLink2URL: http://www.st.com/stonline/products/literature/ds/1765/l9637.pdf

## Sheet RTC.SchDoc
size A4
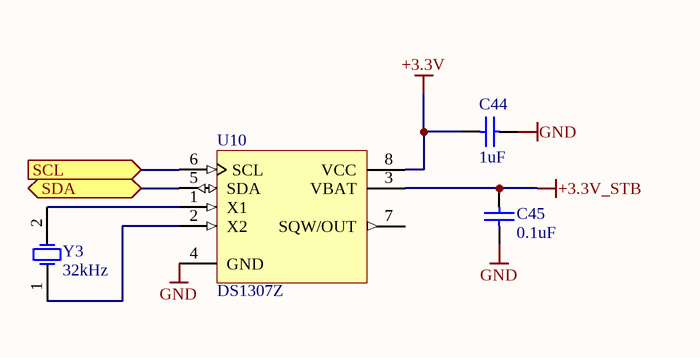
[diagram p7: RTC.SchDoc]

### Parts
C44  1uF  [1608[0603]]
C45  0.1uF  [1608[0603]]
U10  DS1307Z  [SOIC8N_N]
Y3  32kHz  [R38]

### Ports
SCL (in), SDA (bidir)

### Nets
+3.3V: C44.1 U10.8(VCC)
+3.3V_STB: C45.2 U10.3(VBAT)
GND: C44.2 C45.1 U10.4(GND)
I2C2_SCL: U10.6(SCL) ; port SCL
I2C2_SDA: U10.5(SDA) ; port SDA
NetU10_1: U10.1(X1) Y3.2(OSC2)
NetU10_2: U10.2(X2) Y3.1(OSC1)

Not connected (* = marked no-connect by the designer): U10 7(SQW/OUT)

### Library data of the parts
C44 C45 = C0603: as C10 on sheet Power; Published: 17-Jul-2002; LatestRevisionDate: 19-Mar-2004; LatestRevisionNote: Silkscreen size reduced.; DatasheetDocument: Mar-2001; PackageDocument: Mar-2001; PackageReference: 0603; Publisher: Altium Limited; Code_JEITA: 0603; Code_IPC: 1608 [0603]; ComponentLink1Description: Manufacturer Link; ComponentLink1URL: http://www.kemet.com/; ComponentLink2Description: Datasheet; ComponentLink2URL: http://www.kemet.com/kemet/web/homepage/kechome.nsf/vapubfilesname/F3102TA.pdf/$file/F3102TA.pdf
  C44: Value: 1uF
  C45: Value: 0.1uF
U10 = DS1307Z: 64 X 8 Serial Real-Time Clock; Published: 13-Oct-2000; LatestRevisionDate: 13-Apr-2006; LatestRevisionNote: IPC-7351 Footprint Added.; DatasheetVersion: 10-Aug-1999; PackageVersion: 1999; PackageReference: SOIC8N; Publisher: Altium Limited; PackageDescription: 8-Pin Small Outline Integrated Circuit 1.27 mm Pitch; ComponentLink1Description: Manufacturer Link; ComponentLink1URL: http://www.maxim-ic.com/; ComponentLink2Description: Datasheet; ComponentLink2URL: http://pdfserv.maxim-ic.com/en/ds/DS1307.pdf; ComponentLink3Description: Discontinuation Notice; ComponentLink3URL: http://www.maxim-ic.com/qa/pdfs/non-obsolescence-letter.pdf; Code_IPC: SOIC127P600-8
Y3 = XTAL: Crystal Oscillator; Published: 8-Jun-2000; LatestRevisionDate: 17-Jul-2002; LatestRevisionNote: Re-released for DXP Platform.; PackageReference: R38; Publisher: Altium Limited; PackageDescription: Crystal, Thru-Hole; 2 Leads; Body 3.1 x 8.2 mm (Dia.xH)

## Sheet IO.SchDoc
size A4
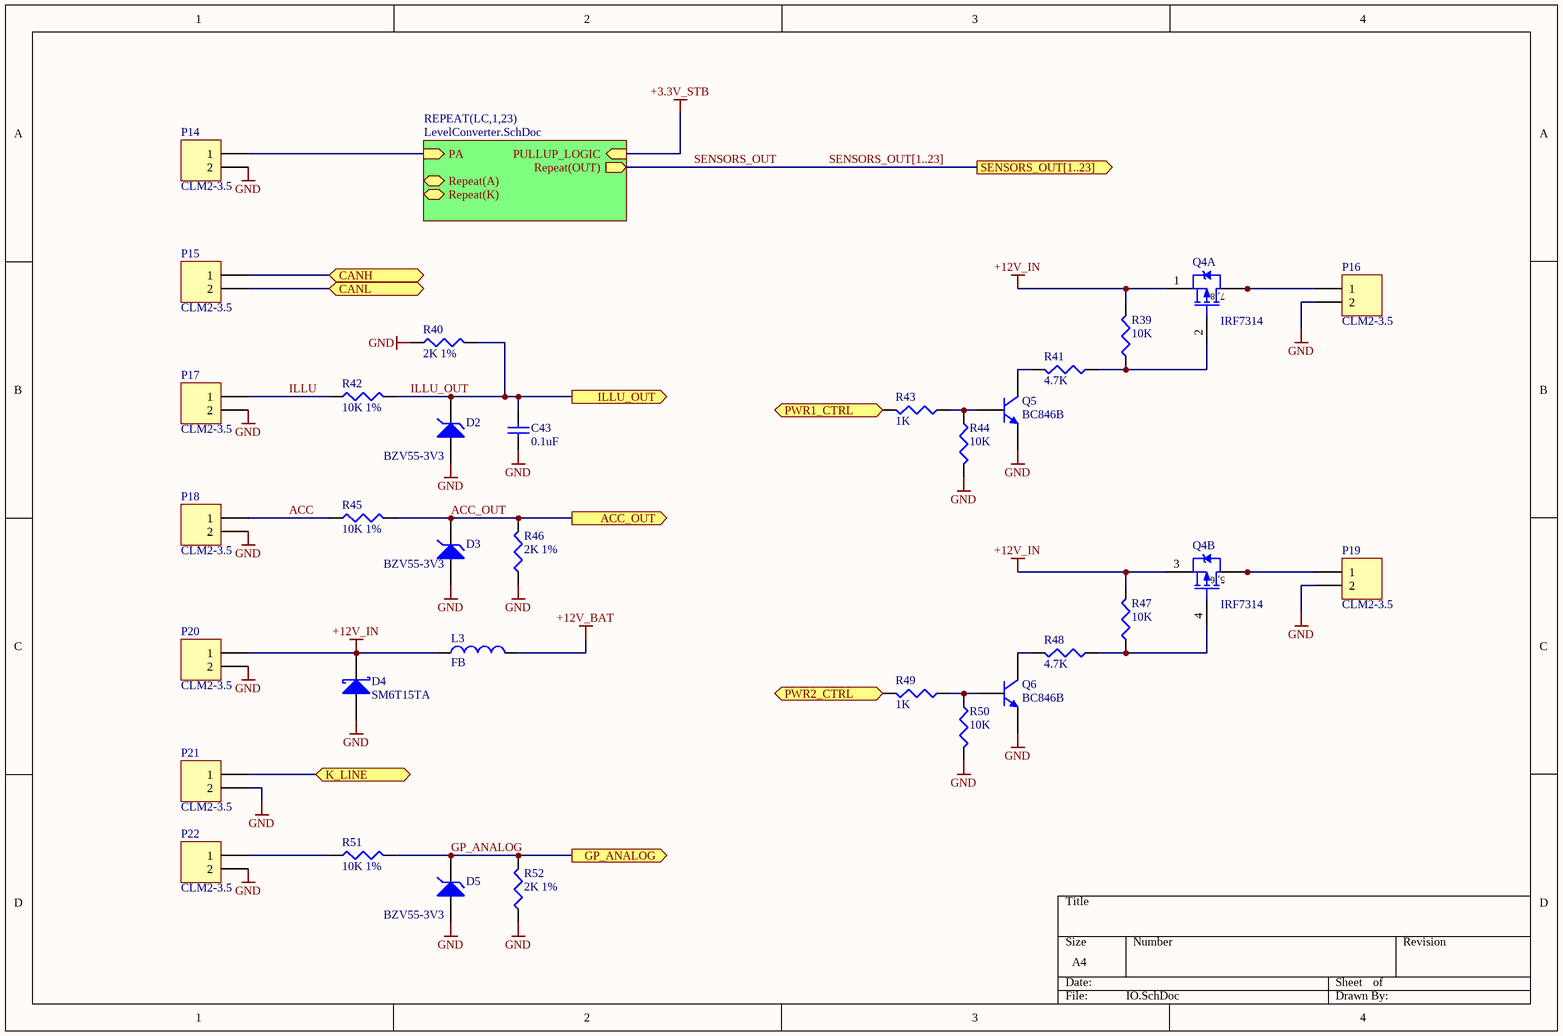
[diagram p8: IO.SchDoc]

### Parts
C43  0.1uF  [2012[0805]]
D2  BZV55-3V3  [SOD-80/MLL34]
D3  BZV55-3V3  [SOD-80/MLL34]
D4  SM6T15TA  [SMB]
D5  BZV55-3V3  [SOD-80/MLL34]
L3  FB  [INDC4516AN]
P14  CLM2-3.5  [CLM2-3.5]
P15  CLM2-3.5  [CLM2-3.5]
P16  CLM2-3.5  [CLM2-3.5]
P17  CLM2-3.5  [CLM2-3.5]
P18  CLM2-3.5  [CLM2-3.5]
P19  CLM2-3.5  [CLM2-3.5]
P20  CLM2-3.5  [CLM2-3.5]
P21  CLM2-3.5  [CLM2-3.5]
P22  CLM2-3.5  [CLM2-3.5]
Q4  IRF7314  [SO-8_N]  (parts A,B of 2)
Q5  BC846B  [SOT23_N]
Q6  BC846B  [SOT23_N]
R39  10K  [R2012[0805]]
R40  2K 1%  [R2012[0805]]
R41  4.7K  [R2012[0805]]
R42  10K 1%  [R2012[0805]]
R43  1K  [R2012[0805]]
R44  10K  [R2012[0805]]
R45  10K 1%  [R2012[0805]]
R46  2K 1%  [R2012[0805]]
R47  10K  [R2012[0805]]
R48  4.7K  [R2012[0805]]
R49  1K  [R2012[0805]]
R50  10K  [R2012[0805]]
R51  10K 1%  [R2012[0805]]
R52  2K 1%  [R2012[0805]]

### Sub-sheets
REPEAT(LC,1,23) = LevelConverter.SchDoc: Repeat(K) (bidir), Repeat(OUT) (out), Repeat(A) (bidir), PULLUP_LOGIC (in), PA (in)

### Ports
ACC_OUT (out), CANH (bidir), CANL (bidir), GP_ANALOG (out), ILLU_OUT (out), K_LINE (bidir), PWR1_CTRL (in), PWR2_CTRL (in), SENSORS_OUT[1..23] (out)

### Nets
+12V_BAT: L3.2
+12V_IN: D4.2(K) L3.1 P20.1 Q4.1(S) Q4.3(S) R39.2 R47.2
GND: C43.1 D2.1(A) D3.1(A) D4.1(A) D5.1(A) P14.2 P16.2 P17.2 P18.2 P19.2 P20.2 P21.2 P22.2 Q5.2(E) Q6.2(E) R40.2 R44.2 R46.2 R50.2 R52.2
ACC: P18.1 R45.2
ACC_OUT: D3.2(K) R45.1 R46.1 ; port ACC_OUT
GP_ANALOG: D5.2(K) R51.1 R52.1 ; port GP_ANALOG
ILLU: P17.1 R42.2
ILLU_OUT: C43.2 D2.2(K) R40.1 R42.1 ; port ILLU_OUT
SENSORS_OUT: sheet REPEAT(LC,1,23)/Repeat(OUT)
NetP14_1: P14.1 ; sheet REPEAT(LC,1,23)/PA
NetP15_1: P15.1 ; port CANH
NetP15_2: P15.2 ; port CANL
NetP16_1: P16.1 Q4.7(D) Q4.8(D)
NetP19_1: P19.1 Q4.5(D) Q4.6(D)
NetP21_1: P21.1 ; port K_LINE
NetP22_1: P22.1 R51.2
NetQ4_2: Q4.2(G) R39.1 R41.1
NetQ4_4: Q4.4(G) R47.1 R48.1
NetQ5_1: Q5.1(B) R43.1 R44.1
NetQ5_3: Q5.3(C) R41.2
NetQ6_1: Q6.1(B) R49.1 R50.1
NetQ6_3: Q6.3(C) R48.2
NetR43_2: R43.2 ; port PWR1_CTRL
NetR49_2: R49.2 ; port PWR2_CTRL

### Buses and harness runs
bus SENSORS_OUT[1..23] = port SENSORS_OUT[1..23]

### Notes on the sheet
- (in symbol IRF7314, part A) 7, 8
- (in symbol IRF7314, part B) 5, 6

### Library data of the parts
C43 = C0805: as C47 on sheet InstrumentCluster; Published: 17-Jul-2002; LatestRevisionDate: 19-Mar-2004; LatestRevisionNote: Silkscreen size reduced.; DatasheetDocument: Mar-2001; PackageDocument: Mar-2001; PackageReference: 0805; Publisher: Altium Limited; Code_JEITA: 0805; Code_IPC: 2012[0805]; ComponentLink1Description: Manufacturer Link; ComponentLink1URL: http://www.kemet.com/; ComponentLink2Description: Datasheet; ComponentLink2URL: http://www.kemet.com/kemet/web/homepage/kechome.nsf/vapubfilesname/F3102TA.pdf/$file/F3102TA.pdf; Value: 0.1uF
D2 D3 D5 = D Zener: Zener Diode; Published: 8-Jun-2000; LatestRevisionDate: 17-Jul-2002; LatestRevisionNote: Re-released for DXP Platform.; PackageReference: DIODE-0.7; Publisher: Altium Limited; PackageDescription: Diode, Thru-Hole; 2 Leads; 0.7 in Pin Spacing
D4 = D Schottky: Published: 8-Jun-2000; LatestRevisionDate: 17-Jul-2002; LatestRevisionNote: Re-released for DXP Platform.; PackageReference: SMB; Publisher: Altium Limited; PackageDescription: DO-214-AA/SMB; 2 C-Bend Leads; Body 5.3 x 3.6 mm, inc. leads (LxW); Code_JEDEC: DO-214-AA
L3 = Inductor: BLM41PG600SN1L; Code_IEC: 1005; Value: 10mH; Published: 8-Jun-2000; LatestRevisionDate: 29-May-2009; LatestRevisionNote: IPC-7351 Footprint Added.; PackageReference: 0402-A; Publisher: Altium Limited; PackageDescription: Chip Inductor; Code_JEITA: 0402
Q4 = IRF7314: HEXFET Power MOSFET; Published: 8-Jun-2000; LatestRevisionDate: 13-Apr-2006; LatestRevisionNote: IPC-7351 Footprint Added.; DatasheetVersion: Nov-1997; PackageVersion: Feb-2001; PackageReference: SO-8; Publisher: Altium Limited; PackageDescription: 8-Pin Plastic Small Outline Integrated Circuit 1.27 mm Pitch; Code_JEDEC: MS-012-AA; Code_IPC: SOIC127P600-8; ComponentLink1Description: Manufacturer Link; ComponentLink1URL: http://www.irf.com/; ComponentLink2Description: Datasheet; ComponentLink2URL: http://www.irf.com/product-info/datasheets/data/irf7314.pdf
Q5 Q6 = BC846B: NPN General-purpose Transistor; Published: 17-Sep-2003; LatestRevisionDate: 12-Dec-2006; LatestRevisionNote: IPC-7351 Footprint Added.; DatasheetVersion: 4-Feb-2002; PackageVersion: May-1999; PackageReference: SOT23; Publisher: Altium Limited; PackageDescription: 3-Pin SOT-23 Package 0.95 mm Pitch, 2.3 mm Lead Span; ComponentLink1Description: Manufacturer Link; ComponentLink1URL: http://www.semiconductors.philips.com/; ComponentLink2Description: Datasheet; ComponentLink2URL: http://www.semiconductors.philips.com/acrobat/datasheets/BC846_BC847_BC848_5.pdf
R39-R52 = R0805: Published: 8-Jun-2000; LatestRevisionDate: 29-May-2009; LatestRevisionNote: IPC-7351 Footprint Added.; PackageReference: J1-0603; Publisher: Altium Limited; PackageDescription: Chip Resistor
  R39 R42 R44 R45 R47 R50 R51: Value: 10K
  R40 R46 R52: Value: 2K
  R41 R48: Value: 4.7K
  R43 R49: Value: 1K

## Sheet LevelConverter.SchDoc
size A4
Used 23 times, as channels U_IO/LC1, U_IO/LC2, U_IO/LC3, U_IO/LC4, U_IO/LC5, U_IO/LC6, U_IO/LC7, U_IO/LC8, U_IO/LC9, U_IO/LC10, U_IO/LC11, U_IO/LC12, U_IO/LC13, U_IO/LC14, U_IO/LC15, U_IO/LC16, U_IO/LC17, U_IO/LC18, U_IO/LC19, U_IO/LC20, U_IO/LC21, U_IO/LC22, U_IO/LC23. Parts and nets are listed once, with the designators drawn on the sheet.
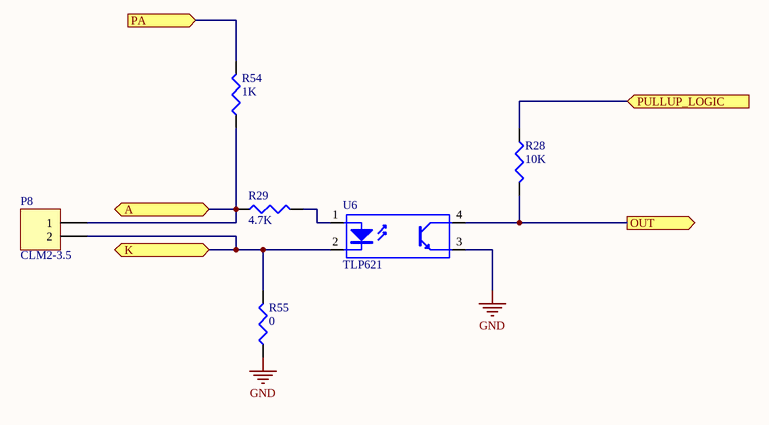
[diagram p9: LevelConverter.SchDoc]

### Parts
P8  CLM2-3.5  [CLM2-3.5]
R28  10K  [R2012[0805]]
R29  4.7K  [R2012[0805]]
R54  1K  [R2012[0805]]
R55  0  [R2012[0805]]
U6  TLP621  [DIP4]

### Ports
A (bidir), K (bidir), OUT (out), PA (in), PULLUP_LOGIC (in)

### Nets
GND: R55.1 U6.3(E)
A: P8.1 R29.1 R54.1 ; port A
K: P8.2 R55.2 U6.2(K) ; port K
OUT: R28.2 U6.4(C) ; port OUT
PA: R54.2 ; port PA
PULLUP_LOGIC: R28.1 ; port PULLUP_LOGIC
NetR29_2: R29.2 U6.1(A)

### Channels
U_IO/LC1: designators end in _LC1; ports A=NetP8_LC1_1 K=NetP8_LC1_2 OUT=SENSORS_OUT1 PA=NetP14_1 PULLUP_LOGIC=+3.3V_STB
U_IO/LC2: designators end in _LC2; ports A=NetP8_LC2_1 K=NetP8_LC2_2 OUT=SENSORS_OUT2 PA=NetP14_1 PULLUP_LOGIC=+3.3V_STB
U_IO/LC3: designators end in _LC3; ports A=NetP8_LC3_1 K=NetP8_LC3_2 OUT=SENSORS_OUT3 PA=NetP14_1 PULLUP_LOGIC=+3.3V_STB
U_IO/LC4: designators end in _LC4; ports A=NetP8_LC4_1 K=NetP8_LC4_2 OUT=SENSORS_OUT4 PA=NetP14_1 PULLUP_LOGIC=+3.3V_STB
U_IO/LC5: designators end in _LC5; ports A=NetP8_LC5_1 K=NetP8_LC5_2 OUT=SENSORS_OUT5 PA=NetP14_1 PULLUP_LOGIC=+3.3V_STB
U_IO/LC6: designators end in _LC6; ports A=NetP8_LC6_1 K=NetP8_LC6_2 OUT=SENSORS_OUT6 PA=NetP14_1 PULLUP_LOGIC=+3.3V_STB
U_IO/LC7: designators end in _LC7; ports A=NetP8_LC7_1 K=NetP8_LC7_2 OUT=SENSORS_OUT7 PA=NetP14_1 PULLUP_LOGIC=+3.3V_STB
U_IO/LC8: designators end in _LC8; ports A=NetP8_LC8_1 K=NetP8_LC8_2 OUT=SENSORS_OUT8 PA=NetP14_1 PULLUP_LOGIC=+3.3V_STB
U_IO/LC9: designators end in _LC9; ports A=NetP8_LC9_1 K=NetP8_LC9_2 OUT=SENSORS_OUT9 PA=NetP14_1 PULLUP_LOGIC=+3.3V_STB
U_IO/LC10: designators end in _LC10; ports A=NetP8_LC10_1 K=NetP8_LC10_2 OUT=SENSORS_OUT10 PA=NetP14_1 PULLUP_LOGIC=+3.3V_STB
U_IO/LC11: designators end in _LC11; ports A=NetP8_LC11_1 K=NetP8_LC11_2 OUT=SENSORS_OUT11 PA=NetP14_1 PULLUP_LOGIC=+3.3V_STB
U_IO/LC12: designators end in _LC12; ports A=NetP8_LC12_1 K=NetP8_LC12_2 OUT=SENSORS_OUT12 PA=NetP14_1 PULLUP_LOGIC=+3.3V_STB
U_IO/LC13: designators end in _LC13; ports A=NetP8_LC13_1 K=NetP8_LC13_2 OUT=SENSORS_OUT13 PA=NetP14_1 PULLUP_LOGIC=+3.3V_STB
U_IO/LC14: designators end in _LC14; ports A=NetP8_LC14_1 K=NetP8_LC14_2 OUT=SENSORS_OUT14 PA=NetP14_1 PULLUP_LOGIC=+3.3V_STB
U_IO/LC15: designators end in _LC15; ports A=NetP8_LC15_1 K=NetP8_LC15_2 OUT=SENSORS_OUT15 PA=NetP14_1 PULLUP_LOGIC=+3.3V_STB
U_IO/LC16: designators end in _LC16; ports A=NetP8_LC16_1 K=NetP8_LC16_2 OUT=SENSORS_OUT16 PA=NetP14_1 PULLUP_LOGIC=+3.3V_STB
U_IO/LC17: designators end in _LC17; ports A=NetP8_LC17_1 K=NetP8_LC17_2 OUT=SENSORS_OUT17 PA=NetP14_1 PULLUP_LOGIC=+3.3V_STB
U_IO/LC18: designators end in _LC18; ports A=NetP8_LC18_1 K=NetP8_LC18_2 OUT=SENSORS_OUT18 PA=NetP14_1 PULLUP_LOGIC=+3.3V_STB
U_IO/LC19: designators end in _LC19; ports A=NetP8_LC19_1 K=NetP8_LC19_2 OUT=SENSORS_OUT19 PA=NetP14_1 PULLUP_LOGIC=+3.3V_STB
U_IO/LC20: designators end in _LC20; ports A=NetP8_LC20_1 K=NetP8_LC20_2 OUT=SENSORS_OUT20 PA=NetP14_1 PULLUP_LOGIC=+3.3V_STB
U_IO/LC21: designators end in _LC21; ports A=NetP8_LC21_1 K=NetP8_LC21_2 OUT=SENSORS_OUT21 PA=NetP14_1 PULLUP_LOGIC=+3.3V_STB
U_IO/LC22: designators end in _LC22; ports A=NetP8_LC22_1 K=NetP8_LC22_2 OUT=SENSORS_OUT22 PA=NetP14_1 PULLUP_LOGIC=+3.3V_STB
U_IO/LC23: designators end in _LC23; ports A=NetP8_LC23_1 K=NetP8_LC23_2 OUT=SENSORS_OUT23 PA=NetP14_1 PULLUP_LOGIC=+3.3V_STB

### Library data of the parts
R28 R29 R54 R55 = R0805: Published: 8-Jun-2000; LatestRevisionDate: 29-May-2009; LatestRevisionNote: IPC-7351 Footprint Added.; PackageReference: J1-0603; Publisher: Altium Limited; PackageDescription: Chip Resistor
  R28: Value: 10K
  R29: Value: 4.7K
  R54: Value: 1K
  R55: Value: 0

## Sheet External Connectors.SchDoc
size A4
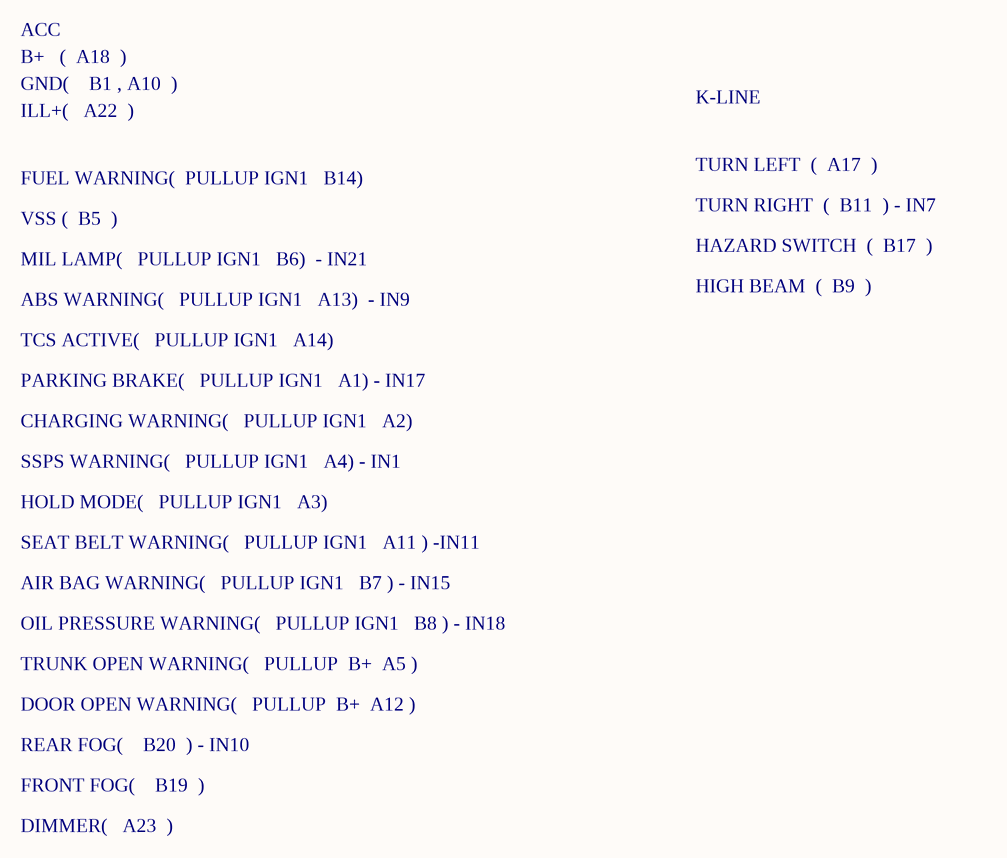
[diagram p10: External Connectors.SchDoc]

### Notes on the sheet
- B+   (  A18  )
- GND(    B1 , A10  )
- ACC
- ILL+(   A22  )
- K-LINE
- FUEL WARNING(  PULLUP IGN1   B14)
- VSS (  B5  )
- TURN LEFT  (  A17  )
- TURN RIGHT  (  B11  ) - IN7
- MIL LAMP(   PULLUP IGN1   B6)  - IN21
- HAZARD SWITCH  (  B17  )
- HIGH BEAM  (  B9  )
- ABS WARNING(   PULLUP IGN1   A13)  - IN9
- TCS ACTIVE(   PULLUP IGN1   A14)
- PARKING BRAKE(   PULLUP IGN1   A1) - IN17
- CHARGING WARNING(   PULLUP IGN1   A2)
- SSPS WARNING(   PULLUP IGN1   A4) - IN1
- HOLD MODE(   PULLUP IGN1   A3)
- SEAT BELT WARNING(   PULLUP IGN1   A11 ) -IN11
- AIR BAG WARNING(   PULLUP IGN1   B7 ) - IN15
- OIL PRESSURE WARNING(   PULLUP IGN1   B8 ) - IN18
- TRUNK OPEN WARNING(   PULLUP  B+  A5 )
- DOOR OPEN WARNING(   PULLUP  B+  A12 )
- REAR FOG(    B20  ) - IN10
- FRONT FOG(    B19  )
- DIMMER(   A23  )